# Altium project BCM_ECU.PrjPcb (part 1 of 2)
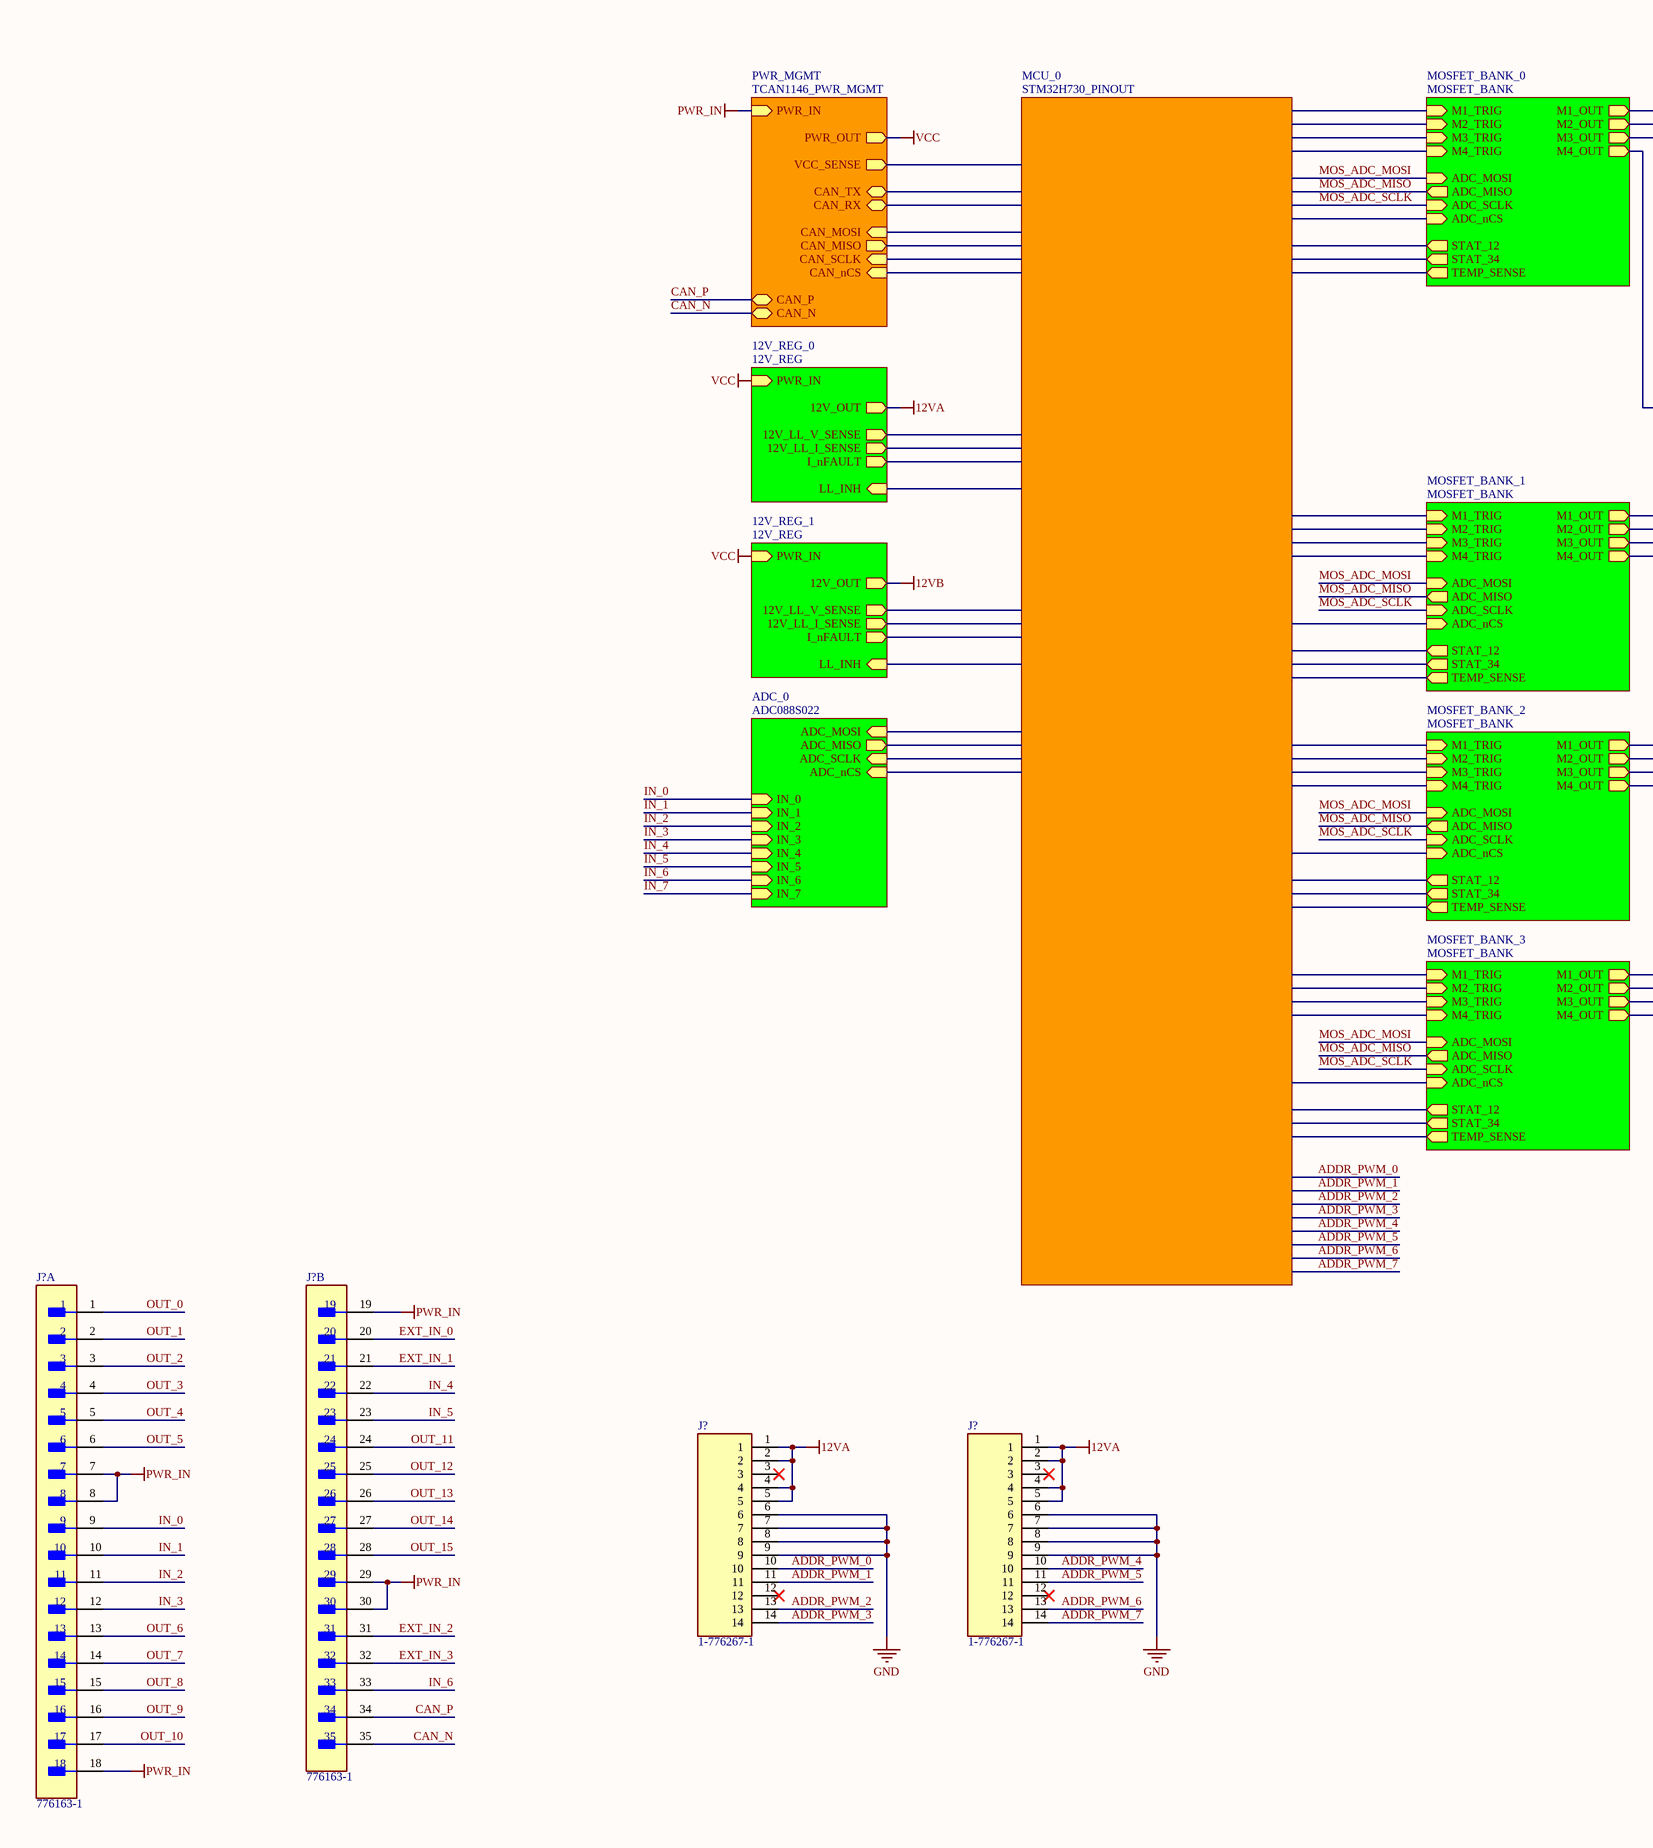
[diagram p0: BCM_ECU.SchDoc, left]
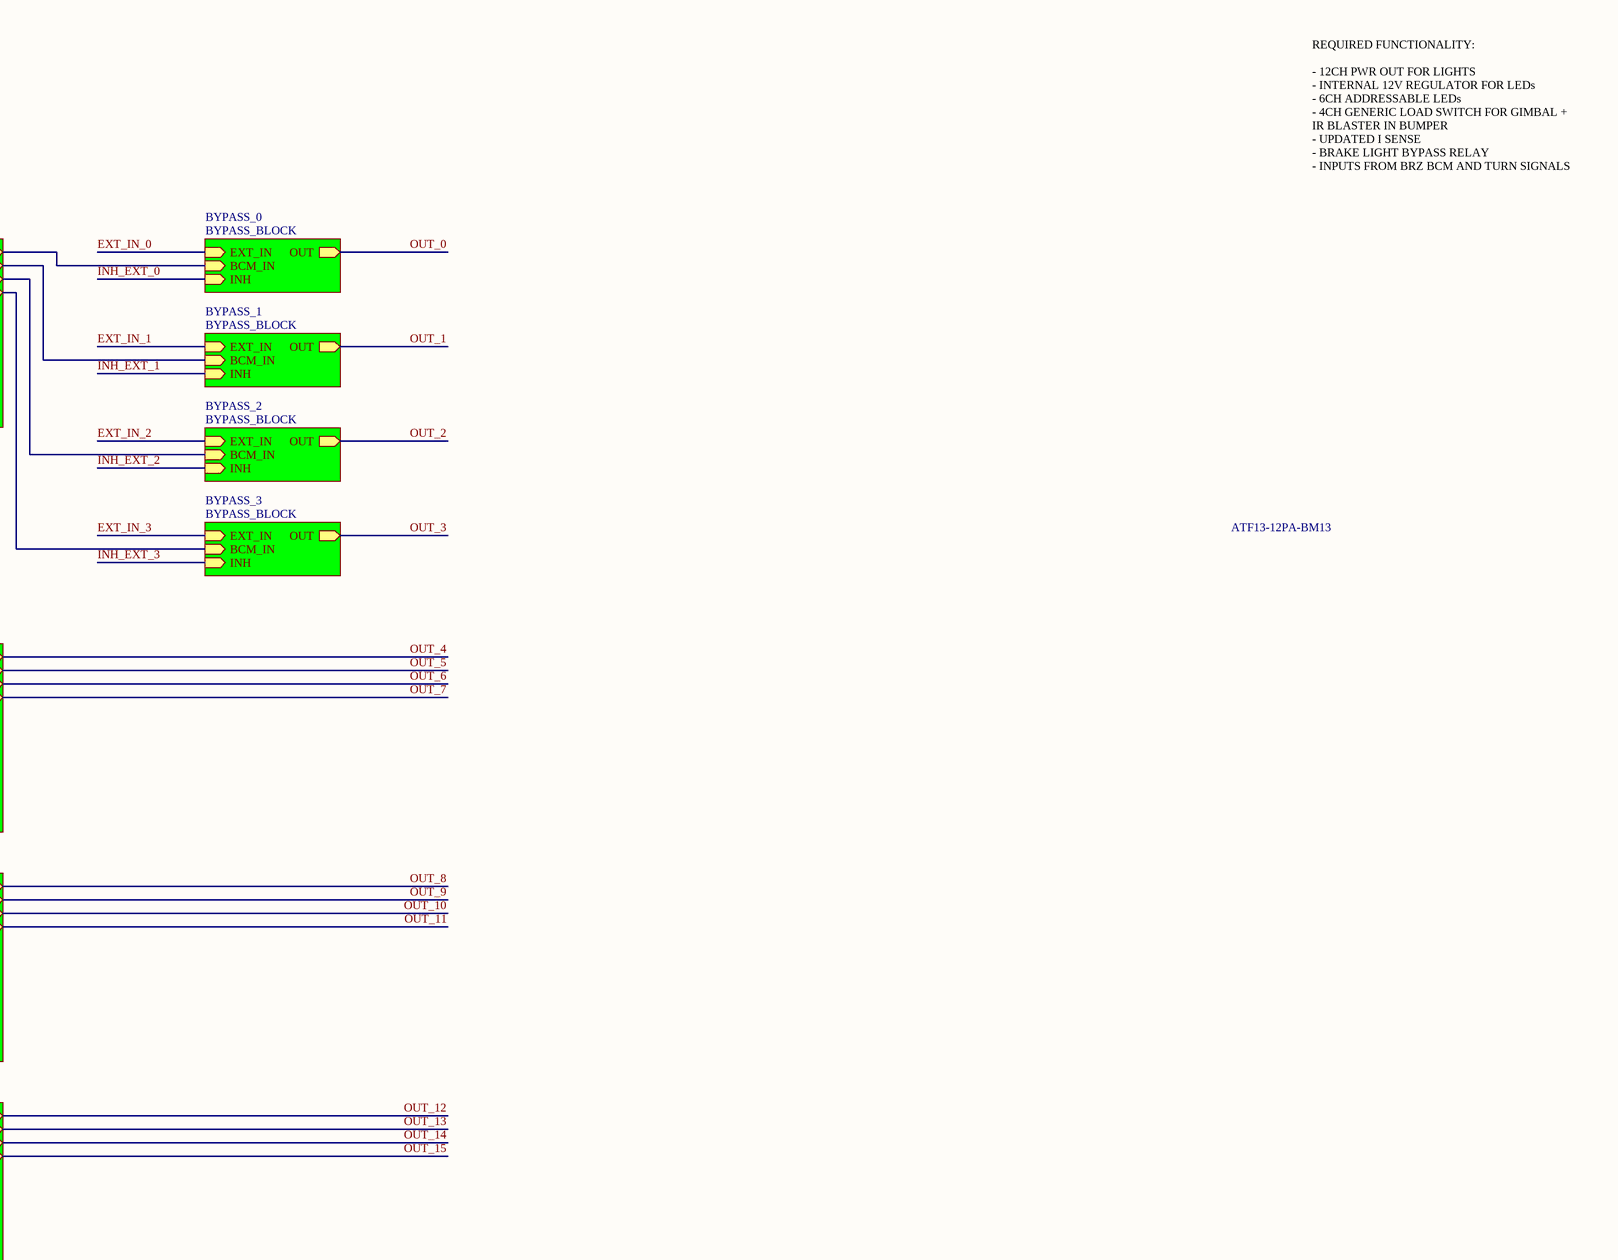
[diagram p1: BCM_ECU.SchDoc, right]
7 sheets, 308 parts. Net scope: hierarchical (ports join the sheet entries above them; power ports are global).
Board file: BCM_ECU_revA.PcbDoc
Sheets:
  BCM_ECU.SchDoc
    MCU_0 = STM32H730_PINOUT.SchDoc
    PWR_MGMT = TCAN1146_PWR_MGMT.SchDoc
    MOSFET_BANK_0 = MOSFET_BANK.SchDoc
    MOSFET_BANK_1 = MOSFET_BANK.SchDoc
    MOSFET_BANK_2 = MOSFET_BANK.SchDoc
    12V_REG_0 = 12V_REG.SchDoc
    12V_REG_1 = 12V_REG.SchDoc
    ADC_0 = ADC088S022.SchDoc
    BYPASS_0 = BYPASS_BLOCK.SchDoc
    MOSFET_BANK_3 = MOSFET_BANK.SchDoc
    BYPASS_1 = BYPASS_BLOCK.SchDoc
    BYPASS_2 = BYPASS_BLOCK.SchDoc
    BYPASS_3 = BYPASS_BLOCK.SchDoc

## Sheet BCM_ECU.SchDoc
size C; SheetNumber: 1; SheetTotal: 7

### Parts
(Parts that share a designator on the sheet are numbered #1, #2 ... from top to bottom, then left to right.)
J?#1  776163-1  [FP-776163-1-MFG]  (part A of 2)
J?#2  776163-1  [FP-776163-1-MFG]  (part B of 2)
J?#3  1-776267-1  [1-776267-2-Footprint-1]
J?#4  1-776267-1  [1-776267-2-Footprint-1]

### Sub-sheets
12V_REG_0 = 12V_REG: PWR_IN (in), LL_INH (in), 12V_OUT (out), 12V_LL_V_SENSE (out), 12V_LL_I_SENSE (out), I_nFAULT (out)
12V_REG_1 = 12V_REG: PWR_IN (in), LL_INH (in), 12V_OUT (out), 12V_LL_V_SENSE (out), 12V_LL_I_SENSE (out), I_nFAULT (out)
ADC_0 = ADC088S022: IN_0 (in), IN_1 (in), IN_2 (in), IN_3 (in), IN_4 (in), IN_5 (in), IN_6 (in), IN_7 (in), ADC_MOSI (in), ADC_MISO (out), ADC_SCLK (in), ADC_nCS (in)
BYPASS_0 = BYPASS_BLOCK: EXT_IN (in), OUT (out), INH (in), BCM_IN (in)
BYPASS_1 = BYPASS_BLOCK: EXT_IN (in), OUT (out), INH (in), BCM_IN (in)
BYPASS_2 = BYPASS_BLOCK: EXT_IN (in), OUT (out), INH (in), BCM_IN (in)
BYPASS_3 = BYPASS_BLOCK: EXT_IN (in), OUT (out), INH (in), BCM_IN (in)
MCU_0 = STM32H730_PINOUT: no entries
MOSFET_BANK_0 = MOSFET_BANK: M1_OUT (out), M2_OUT (out), M3_OUT (out), M4_OUT (out), M1_TRIG (in), M2_TRIG (in), M3_TRIG (in), M4_TRIG (in), STAT_12 (out), STAT_34 (out), ADC_MOSI (in), ADC_MISO (out), ADC_SCLK (in), ADC_nCS (in), TEMP_SENSE (out)
MOSFET_BANK_1 = MOSFET_BANK: M1_OUT (out), M2_OUT (out), M3_OUT (out), M4_OUT (out), M1_TRIG (in), M2_TRIG (in), M3_TRIG (in), M4_TRIG (in), STAT_12 (out), STAT_34 (out), ADC_MOSI (in), ADC_MISO (out), ADC_SCLK (in), ADC_nCS (in), TEMP_SENSE (out)
MOSFET_BANK_2 = MOSFET_BANK: M1_OUT (out), M2_OUT (out), M3_OUT (out), M4_OUT (out), M1_TRIG (in), M2_TRIG (in), M3_TRIG (in), M4_TRIG (in), STAT_12 (out), STAT_34 (out), ADC_MOSI (in), ADC_MISO (out), ADC_SCLK (in), ADC_nCS (in), TEMP_SENSE (out)
MOSFET_BANK_3 = MOSFET_BANK: M1_OUT (out), M2_OUT (out), M3_OUT (out), M4_OUT (out), M1_TRIG (in), M2_TRIG (in), M3_TRIG (in), M4_TRIG (in), STAT_12 (out), STAT_34 (out), ADC_MOSI (in), ADC_MISO (out), ADC_SCLK (in), ADC_nCS (in), TEMP_SENSE (out)
PWR_MGMT = TCAN1146_PWR_MGMT: PWR_IN (in), PWR_OUT (out), VCC_SENSE (out), CAN_TX (bidir), CAN_RX (bidir), CAN_SCLK (in), CAN_MISO (out), CAN_MOSI (in), CAN_nCS (in), CAN_P (bidir), CAN_N (bidir)

### Nets
12VA: J?#3.1 J?#3.2 J?#3.4 J?#3.5 J?#4.1 J?#4.2 J?#4.4 J?#4.5 ; sheet 12V_REG_0/12V_OUT  [project net 12V_OUT]
GND: J?#3.6 J?#3.7 J?#3.8 J?#3.9 J?#4.6 J?#4.7 J?#4.8 J?#4.9
PWR_IN: J?#1.7 J?#1.8 J?#1.18 J?#2.19 J?#2.29 J?#2.30 ; sheet PWR_MGMT/PWR_IN
VCC: sheet PWR_MGMT/PWR_OUT, sheet 12V_REG_0/PWR_IN, sheet 12V_REG_1/PWR_IN  [project net PWR_IN]
ADDR_PWM_0: J?#3.10
ADDR_PWM_1: J?#3.11
ADDR_PWM_2: J?#3.13
ADDR_PWM_3: J?#3.14
ADDR_PWM_4: J?#4.10
ADDR_PWM_5: J?#4.11
ADDR_PWM_6: J?#4.13
ADDR_PWM_7: J?#4.14
CAN_N: J?#2.35 ; sheet PWR_MGMT/CAN_N
CAN_P: J?#2.34 ; sheet PWR_MGMT/CAN_P
EXT_IN_0: J?#2.20 ; sheet BYPASS_0/EXT_IN
EXT_IN_1: J?#2.21 ; sheet BYPASS_1/EXT_IN
EXT_IN_2: J?#2.31 ; sheet BYPASS_2/EXT_IN
EXT_IN_3: J?#2.32 ; sheet BYPASS_3/EXT_IN
IN_0: J?#1.9 ; sheet ADC_0/IN_0
IN_1: J?#1.10 ; sheet ADC_0/IN_1
IN_2: J?#1.11 ; sheet ADC_0/IN_2
IN_3: J?#1.12 ; sheet ADC_0/IN_3
IN_4: J?#2.22 ; sheet ADC_0/IN_4
IN_5: J?#2.23 ; sheet ADC_0/IN_5
IN_6: J?#2.33 ; sheet ADC_0/IN_6
IN_7: sheet ADC_0/IN_7
MOS_ADC_MISO: sheet MOSFET_BANK_0/ADC_MISO, sheet MOSFET_BANK_1/ADC_MISO, sheet MOSFET_BANK_2/ADC_MISO, sheet MOSFET_BANK_3/ADC_MISO  [project net ADC_MISO]
MOS_ADC_MOSI: sheet MOSFET_BANK_0/ADC_MOSI, sheet MOSFET_BANK_1/ADC_MOSI, sheet MOSFET_BANK_2/ADC_MOSI, sheet MOSFET_BANK_3/ADC_MOSI  [project net ADC_MOSI]
MOS_ADC_SCLK: sheet MOSFET_BANK_0/ADC_SCLK, sheet MOSFET_BANK_1/ADC_SCLK, sheet MOSFET_BANK_2/ADC_SCLK, sheet MOSFET_BANK_3/ADC_SCLK  [project net ADC_SCLK]
OUT_0: J?#1.1 ; sheet MOSFET_BANK_0/M1_OUT, sheet BYPASS_0/OUT, sheet BYPASS_0/BCM_IN  [project net M1_OUT]
OUT_1: J?#1.2 ; sheet MOSFET_BANK_0/M2_OUT, sheet BYPASS_1/OUT, sheet BYPASS_1/BCM_IN  [project net M2_OUT]
OUT_2: J?#1.3 ; sheet MOSFET_BANK_0/M3_OUT, sheet BYPASS_2/OUT, sheet BYPASS_2/BCM_IN  [project net M3_OUT]
OUT_3: J?#1.4 ; sheet MOSFET_BANK_0/M4_OUT, sheet BYPASS_3/OUT, sheet BYPASS_3/BCM_IN  [project net M4_OUT]
OUT_4: J?#1.5 ; sheet MOSFET_BANK_1/M1_OUT  [project net M1_OUT]
OUT_5: J?#1.6 ; sheet MOSFET_BANK_1/M2_OUT  [project net M2_OUT]
OUT_6: J?#1.13 ; sheet MOSFET_BANK_1/M3_OUT  [project net M3_OUT]
OUT_7: J?#1.14 ; sheet MOSFET_BANK_1/M4_OUT  [project net M4_OUT]
OUT_8: J?#1.15 ; sheet MOSFET_BANK_2/M1_OUT  [project net M1_OUT]
OUT_9: J?#1.16 ; sheet MOSFET_BANK_2/M2_OUT  [project net M2_OUT]
OUT_10: J?#1.17 ; sheet MOSFET_BANK_2/M3_OUT  [project net M3_OUT]
OUT_11: J?#2.24 ; sheet MOSFET_BANK_2/M4_OUT  [project net M4_OUT]
OUT_12: J?#2.25 ; sheet MOSFET_BANK_3/M1_OUT  [project net M1_OUT]
OUT_13: J?#2.26 ; sheet MOSFET_BANK_3/M2_OUT  [project net M2_OUT]
OUT_14: J?#2.27 ; sheet MOSFET_BANK_3/M3_OUT  [project net M3_OUT]
OUT_15: J?#2.28 ; sheet MOSFET_BANK_3/M4_OUT  [project net M4_OUT]

Not connected (* = marked no-connect by the designer): J?#3 3* 12*; J?#4 3* 12*

### Notes on the sheet
- REQUIRED FUNCTIONALITY:
  - 12CH PWR OUT FOR LIGHTS
  - INTERNAL 12V REGULATOR FOR LEDs
  - 6CH ADDRESSABLE LEDs
  - 4CH GENERIC LOAD SWITCH FOR GIMBAL + IR BLASTER IN BUMPER
  - UPDATED I SENSE
  - BRAKE LIGHT BYPASS RELAY
  - INPUTS FROM BRZ BCM AND TURN SIGNALS
- ATF13-12PA-BM13

### Library data of the parts
J?#1 J?#2 = CMP-03369-000154-1: CONN HEADER R/A 35POS 4MM; Primary Type: Rectangular; Circuit Application: Power; Tab Thickness: 1.3mm; Number of Signal Positions: 35; Shielding: Unshielded; Pitch: 0.157inch; Max Voltage Rating (AC): 250V; Connector System: Wire-to-Device; Insulation: Insulated; Current Rating: 17A; PCB Thickness: 0.062inch; PCB Mount Retention: With; Gender: Male; Connector Type: Male Pin; PCB Mount Alignment: Yes (With); Series: Ampseal; Depth: 37.9mm; Orientation: Right Angle; Length: 3.03inch; Termination: Solder; Radiation Hardening: No; Number of Rows: 3; Contact Plating: Tin; Lead Free: Lead Free; Flammability Rating: UL94 V-0; Contact Material: Brass; Number of Contacts: 35; ELV: Compliant; Max Operating Temperature: 221°C; Min Operating Temperature: -40°C; Package Quantity: 1; Mount: Through Hole; Contact Type: Male Pin; Housing Material: Thermoplastic; Number of Positions: 35; Packaging: Bulk; Row Spacing: 0.157inch; RoHS Compliant: Yes; Height: 32.1mm; Color: Black; Fastening Type: Ramp; Sealable: Yes (With); Width: 37.9mm
J?#3 J?#4 = CMP-002-00075-1: Combination Line Connector, 14 Contact(s), Male, Solder Terminal - MODEL IS CODE2 BUT USE CODE1; RoHS Compliant: Yes; Mounting Technology: Board

## Sheet STM32H730_PINOUT.SchDoc
size C; SheetNumber: 4; SheetTotal: 9
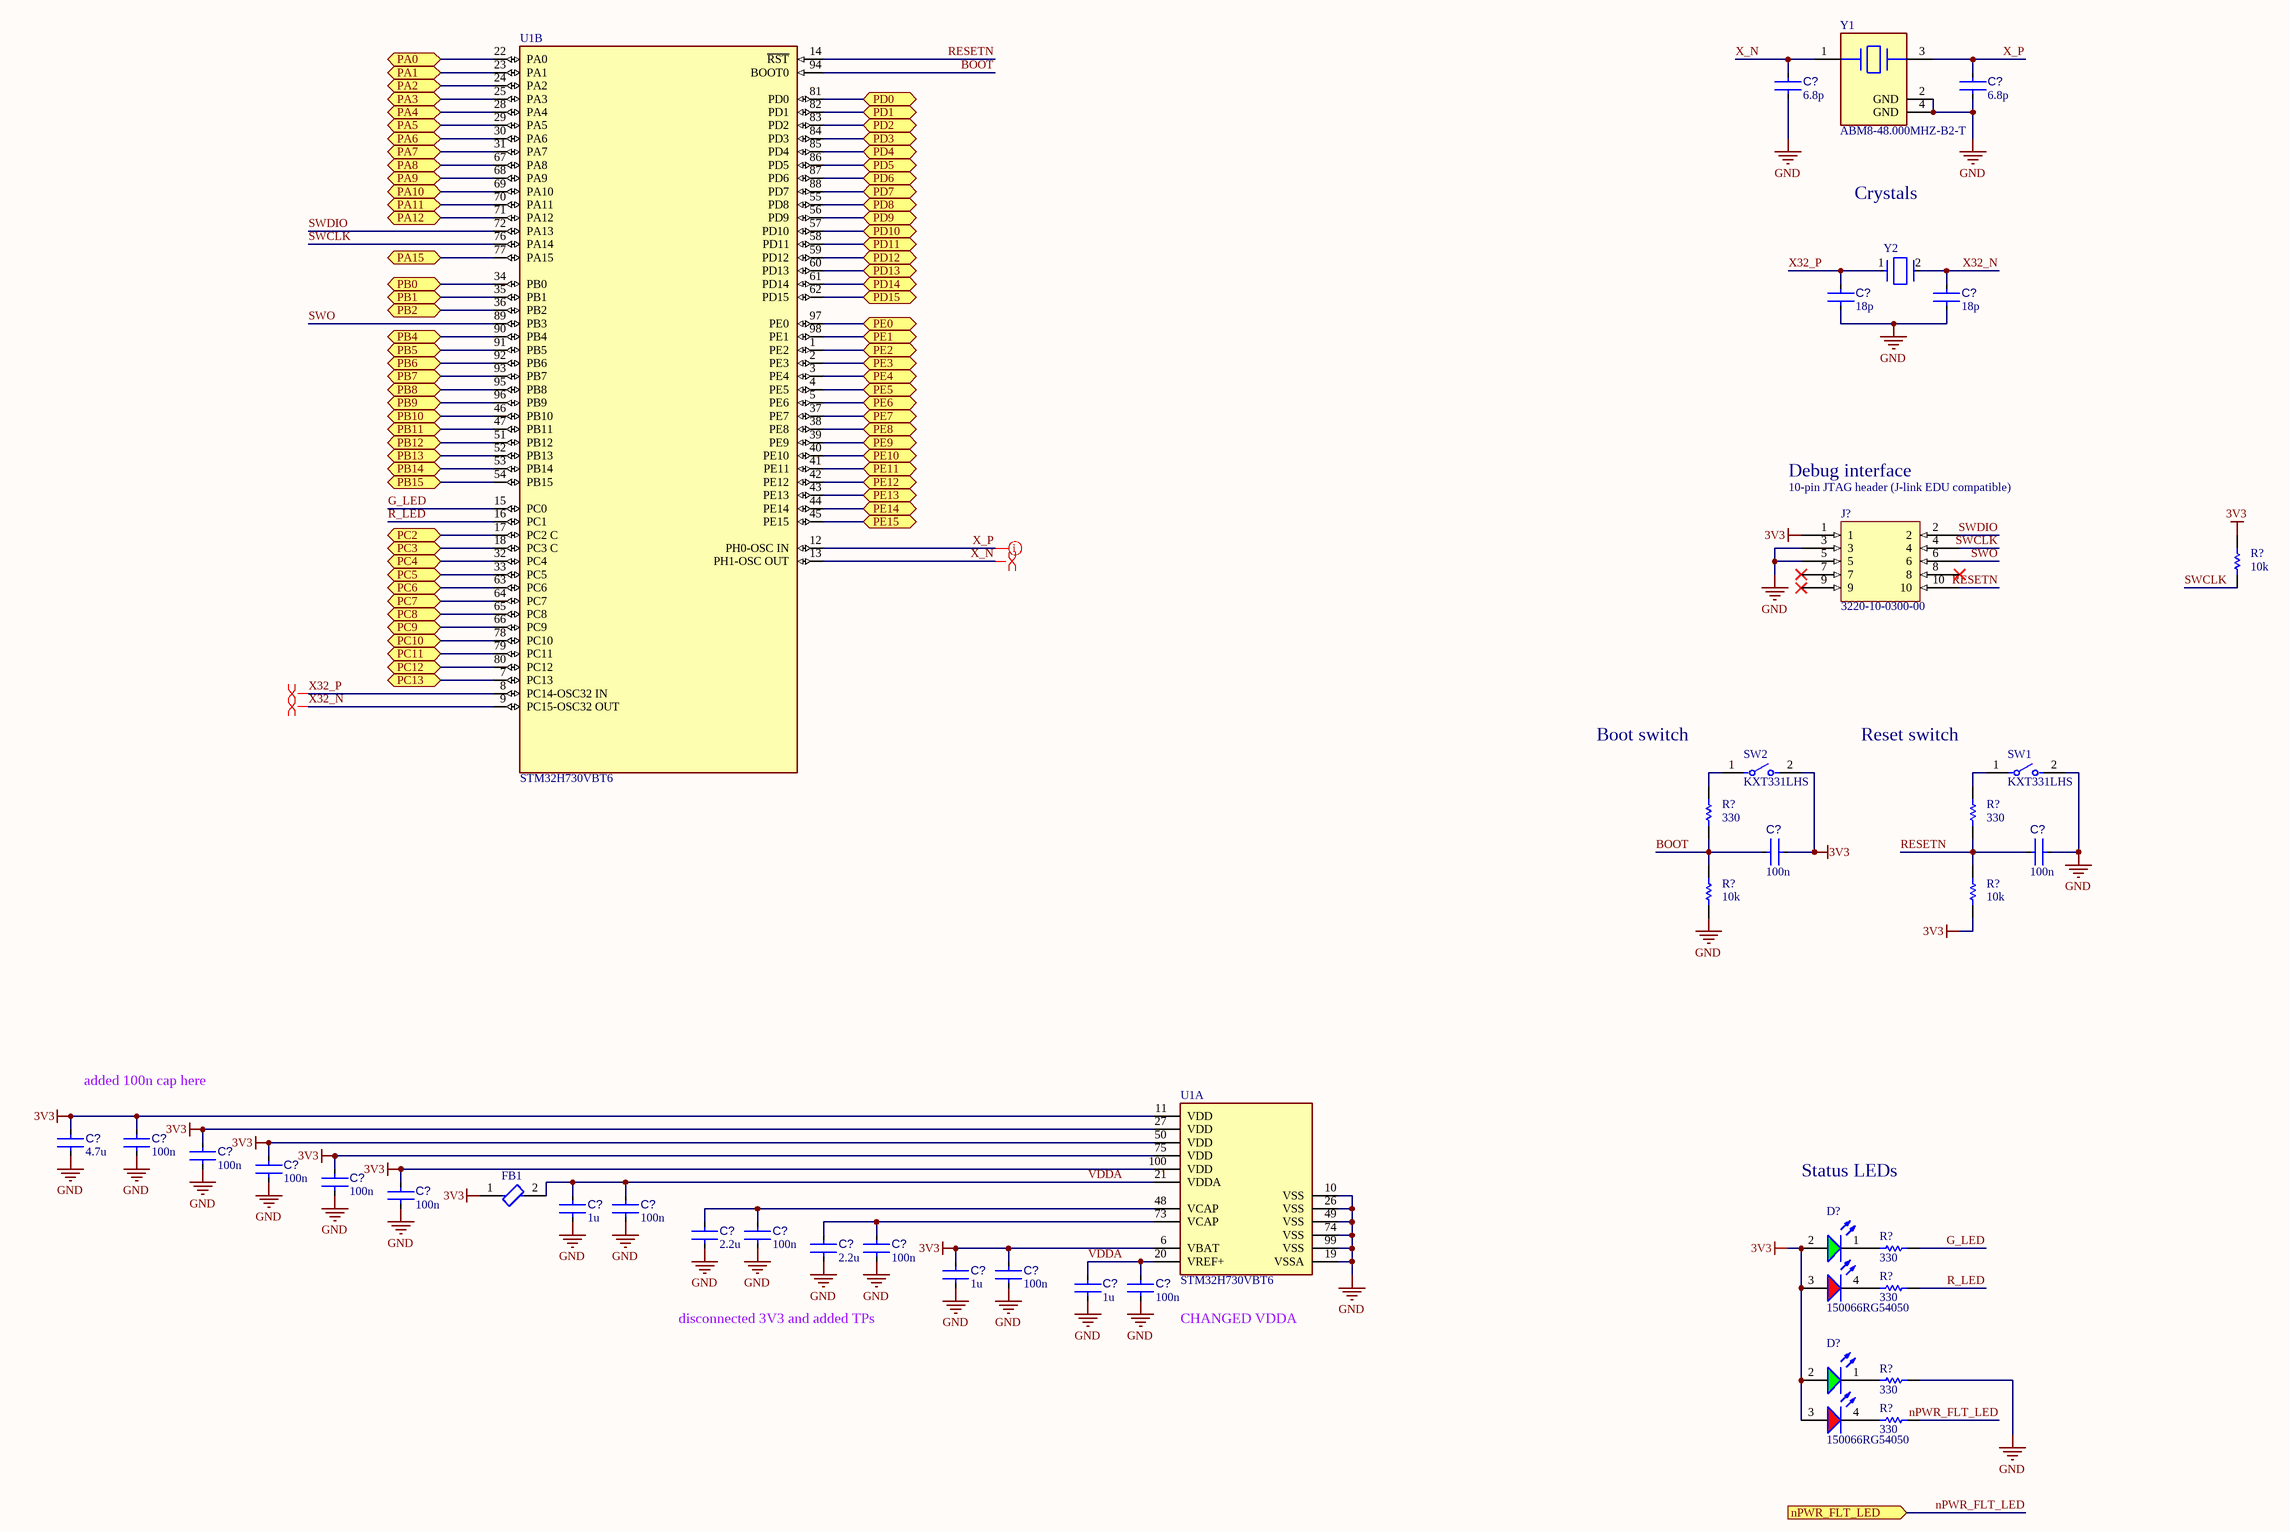
[diagram p2: STM32H730_PINOUT.SchDoc]

### Parts
(Parts that share a designator on the sheet are numbered #1, #2 ... from top to bottom, then left to right.)
C?#1  6.8p  [C0402B]
C?#2  6.8p  [C0402B]
C?#3  18p  [C0402B]
C?#4  18p  [C0402B]
C?#5  100n  [C0402B]
C?#6  100n  [C0402B]
C?#7  4.7u  [C0402B]
C?#8  100n  [C0402B]
C?#9  100n  [C0402B]
C?#10  100n  [C0402B]
C?#11  100n  [C0402B]
C?#12  100n  [C0402B]
C?#13  1u  [C0402B]
C?#14  100n  [C0402B]
C?#15  2.2u  [C0402B]
C?#16  100n  [C0402B]
C?#17  2.2u  [C0402B]
C?#18  100n  [C0402B]
C?#19  1u  [C0402B]
C?#20  100n  [C0402B]
C?#21  1u  [C0402B]
C?#22  100n  [C0402B]
D?#1  150066RG54050  [WL-SBCD_0606]
D?#2  150066RG54050  [WL-SBCD_0606]
FB1  BLM15PX601SN1D  [FP-BLM15-0_05-IPC_A]  (value not drawn)
J?#5  3220-10-0300-00  [3220-10-0300-00-Footprint-1]
R?#1  10k  [R0603B]
R?#2  330  [R0603B]
R?#3  330  [R0603B]
R?#4  10k  [R0603B]
R?#5  10k  [R0603B]
R?#6  330  [R0603B]
R?#7  330  [R0603B]
R?#8  330  [R0603B]
R?#9  330  [R0603B]
SW1  KXT331LHS  [FP-KXT331LHS-MFG]
SW2  KXT331LHS  [FP-KXT331LHS-MFG]
U1  STM32H730VBT6  [FP-LQFP100-1L-IPC_C]  (parts A,B of 2)
Y1  ABM8-48.000MHZ-B2-T  [FP-ABM8-MFG]
Y2  ECS-.327-12.5-1210-TR  [FP-ECX-1210-MFG]  (value not drawn)

### Ports
nPWR_FLT_LED (in), PA0 (bidir), PA1 (bidir), PA2 (bidir), PA3 (bidir), PA4 (bidir), PA5 (bidir), PA6 (bidir), PA7 (bidir), PA8 (bidir), PA9 (bidir), PA10 (bidir), PA11 (bidir), PA12 (bidir), PA15 (bidir), PB0 (bidir), PB1 (bidir), PB2 (bidir), PB4 (bidir), PB5 (bidir), PB6 (bidir), PB7 (bidir), PB8 (bidir), PB9 (bidir), PB10 (bidir), PB11 (bidir), PB12 (bidir), PB13 (bidir), PB14 (bidir), PB15 (bidir), PC2 (bidir), PC3 (bidir), PC4 (bidir), PC5 (bidir), PC6 (bidir), PC7 (bidir), PC8 (bidir), PC9 (bidir), PC10 (bidir), PC11 (bidir), PC12 (bidir), PC13 (bidir), PD0 (bidir), PD1 (bidir), PD2 (bidir), PD3 (bidir), PD4 (bidir), PD5 (bidir), PD6 (bidir), PD7 (bidir), PD8 (bidir), PD9 (bidir), PD10 (bidir), PD11 (bidir), PD12 (bidir), PD13 (bidir), PD14 (bidir), PD15 (bidir), PE0 (bidir), PE1 (bidir), PE2 (bidir), PE3 (bidir), PE4 (bidir), PE5 (bidir), PE6 (bidir), PE7 (bidir), PE8 (bidir), PE9 (bidir), PE10 (bidir), PE11 (bidir), PE12 (bidir), PE13 (bidir), PE14 (bidir), PE15 (bidir)

### Nets
3V3: C?#5.1 C?#7.2 C?#8.2 C?#9.2 C?#10.2 C?#11.2 C?#12.2 C?#19.2 C?#20.2 D?#1.2(A) D?#1.3(A) D?#2.2(A) D?#2.3(A) FB1.1 J?#5.1 R?#1.2 R?#5.1 SW2.2 U1.6(VBAT) U1.11(VDD) U1.27(VDD) U1.50(VDD) U1.75(VDD) U1.100(VDD)
GND: C?#1.1 C?#2.1 C?#3.1 C?#4.1 C?#6.1 C?#7.1 C?#8.1 C?#9.1 C?#10.1 C?#11.1 C?#12.1 C?#13.1 C?#14.1 C?#15.1 C?#16.1 C?#17.1 C?#18.1 C?#19.1 C?#20.1 C?#21.1 C?#22.1 J?#5.3 J?#5.5 R?#4.1 R?#8.1 SW1.2 U1.10(VSS) U1.19(VSSA) U1.26(VSS) U1.49(VSS) U1.74(VSS) U1.99(VSS) Y1.2(GND) Y1.4(GND)
BOOT: C?#5.2 R?#2.1 R?#4.2 U1.94(BOOT0)
G_LED: R?#6.1 U1.15(PC0)
nPWR_FLT_LED: R?#9.1 ; port nPWR_FLT_LED
R_LED: R?#7.1 U1.16(PC1)
RESETN: C?#6.2 J?#5.10 R?#3.1 R?#5.2 U1.14(~{RST})
SWCLK: J?#5.4 R?#1.1 U1.76(PA14)
SWDIO: J?#5.2 U1.72(PA13)
SWO: J?#5.6 U1.89(PB3)
VDDA: C?#13.2 C?#14.2 C?#21.2 C?#22.2 FB1.2 U1.20(VREF+) U1.21(VDDA)
X32_N: C?#4.2 U1.9(PC15-OSC32_OUT) Y2.2(Out/In)
X32_P: C?#3.2 U1.8(PC14-OSC32_IN) Y2.1(In/Out)
X_N: C?#1.2 U1.13(PH1-OSC_OUT) Y1.1
X_P: C?#2.2 U1.12(PH0-OSC_IN) Y1.3
NetC?#15_2: C?#15.2 C?#16.2 U1.48(VCAP)
NetC?#17_2: C?#17.2 C?#18.2 U1.73(VCAP)
NetD?#1_1: D?#1.1(K) R?#6.2
NetD?#1_4: D?#1.4(K) R?#7.2
NetD?#2_1: D?#2.1(K) R?#8.2
NetD?#2_4: D?#2.4(K) R?#9.2
NetR?#2_2: R?#2.2 SW2.1
NetR?#3_2: R?#3.2 SW1.1
NetU1_1: U1.1(PE2) ; port PE2
NetU1_2: U1.2(PE3) ; port PE3
NetU1_3: U1.3(PE4) ; port PE4
NetU1_4: U1.4(PE5) ; port PE5
NetU1_5: U1.5(PE6) ; port PE6
NetU1_7: U1.7(PC13) ; port PC13
NetU1_17: U1.17(PC2_C) ; port PC2
NetU1_18: U1.18(PC3_C) ; port PC3
NetU1_22: U1.22(PA0) ; port PA0
NetU1_23: U1.23(PA1) ; port PA1
NetU1_24: U1.24(PA2) ; port PA2
NetU1_25: U1.25(PA3) ; port PA3
NetU1_28: U1.28(PA4) ; port PA4
NetU1_29: U1.29(PA5) ; port PA5
NetU1_30: U1.30(PA6) ; port PA6
NetU1_31: U1.31(PA7) ; port PA7
NetU1_32: U1.32(PC4) ; port PC4
NetU1_33: U1.33(PC5) ; port PC5
NetU1_34: U1.34(PB0) ; port PB0
NetU1_35: U1.35(PB1) ; port PB1
NetU1_36: U1.36(PB2) ; port PB2
NetU1_37: U1.37(PE7) ; port PE7
NetU1_38: U1.38(PE8) ; port PE8
NetU1_39: U1.39(PE9) ; port PE9
NetU1_40: U1.40(PE10) ; port PE10
NetU1_41: U1.41(PE11) ; port PE11
NetU1_42: U1.42(PE12) ; port PE12
NetU1_43: U1.43(PE13) ; port PE13
NetU1_44: U1.44(PE14) ; port PE14
NetU1_45: U1.45(PE15) ; port PE15
NetU1_46: U1.46(PB10) ; port PB10
NetU1_47: U1.47(PB11) ; port PB11
NetU1_51: U1.51(PB12) ; port PB12
NetU1_52: U1.52(PB13) ; port PB13
NetU1_53: U1.53(PB14) ; port PB14
NetU1_54: U1.54(PB15) ; port PB15
NetU1_55: U1.55(PD8) ; port PD8
NetU1_56: U1.56(PD9) ; port PD9
NetU1_57: U1.57(PD10) ; port PD10
NetU1_58: U1.58(PD11) ; port PD11
NetU1_59: U1.59(PD12) ; port PD12
NetU1_60: U1.60(PD13) ; port PD13
NetU1_61: U1.61(PD14) ; port PD14
NetU1_62: U1.62(PD15) ; port PD15
NetU1_63: U1.63(PC6) ; port PC6
NetU1_64: U1.64(PC7) ; port PC7
NetU1_65: U1.65(PC8) ; port PC8
NetU1_66: U1.66(PC9) ; port PC9
NetU1_67: U1.67(PA8) ; port PA8
NetU1_68: U1.68(PA9) ; port PA9
NetU1_69: U1.69(PA10) ; port PA10
NetU1_70: U1.70(PA11) ; port PA11
NetU1_71: U1.71(PA12) ; port PA12
NetU1_77: U1.77(PA15) ; port PA15
NetU1_78: U1.78(PC10) ; port PC10
NetU1_79: U1.79(PC11) ; port PC11
NetU1_80: U1.80(PC12) ; port PC12
NetU1_81: U1.81(PD0) ; port PD0
NetU1_82: U1.82(PD1) ; port PD1
NetU1_83: U1.83(PD2) ; port PD2
NetU1_84: U1.84(PD3) ; port PD3
NetU1_85: U1.85(PD4) ; port PD4
NetU1_86: U1.86(PD5) ; port PD5
NetU1_87: U1.87(PD6) ; port PD6
NetU1_88: U1.88(PD7) ; port PD7
NetU1_90: U1.90(PB4) ; port PB4
NetU1_91: U1.91(PB5) ; port PB5
NetU1_92: U1.92(PB6) ; port PB6
NetU1_93: U1.93(PB7) ; port PB7
NetU1_95: U1.95(PB8) ; port PB8
NetU1_96: U1.96(PB9) ; port PB9
NetU1_97: U1.97(PE0) ; port PE0
NetU1_98: U1.98(PE1) ; port PE1

Not connected (* = marked no-connect by the designer): J?#5 7* 8* 9*

### Layout directives
differential pair: X32_N, X32_P, X_N, X_P

### Notes on the sheet
- Crystals
- Debug interface
- (near J?#5) 10-pin JTAG header (J-link EDU compatible)
- Boot switch
- Reset switch
- (near C?#8) added 100n cap here
- Status LEDs
- disconnected 3V3 and added TPs
- CHANGED VDDA

### Library data of the parts
C?#1-C?#22 = CMP-001-00000-11: Non-polarized capacitor
D?#1 D?#2 = CMP-004-00040-2: Led, Red/Grn, 180Mcd/230Mcd, 624Nm/525Nm Rohs Compliant: Yes; Source: rgled.SchLib; Component Type: Standard; Design Item ID: CMP-004-00034-2; Pins: 4
FB1 = CMP-0686-00252-4: Chip Ferrite Bead, 0402, 600Ω @ 100MHz, 0.23Ω, 25%, 900mA; Number of Circuits: 1; Impedance: 600R; DC Resistance (DCR): 230mR; Material: Steel; Length: 1mm; Package Quantity: 10000; Height: 0.5mm; Width: 0.5mm; Max DC Current: 900mA; Number of Lines: 1; Termination: SMD/SMT; Packaging: Tape and Reel; Lead Free: Lead Free; Min Operating Temperature: -55°C; Max Operating Temperature: 125°C; Max Current Rating: 900mA; Case Code (Imperial): 0402; Number of Pins: 2; Current Rating: 900mA; Test Frequency: 100MHz; Case/Package: 0402; Tolerance: 25%; Case Code (Metric): 1005
J?#5 = CMP-001-0013-3: CONN HEADER SMD 10POS 1.27MM
R?#1-R?#9 = CMP-009-00002-14: Resistor
  R?#1 R?#4 R?#5: Value: 10k
  R?#2 R?#3 R?#6-R?#9: Value: 330
SW1 SW2 = CMP-10040-000029-1: SWITCH TACTILE SPST-NO 0.02A 15V; Operating Force: 240gf; Switch Travel: 0.13mm; Illumination Type: Non-Illuminated; Throw Configuration: SPST; Number of Ports: 1; Current Rating: 5A; Mechanical Life: 500000Cycles; Switch Function: Off-Mom; Connector Type: USB; Actuator Type: Standard; Gender: Receptacle; Number of Contacts: 24; Contact Plating: Gold; Insulation Color: Black; Min Operating Temperature: -40°C; Packaging: Tape and Reel; Flammability Rating: UL94 V-0; Max Operating Temperature: 85°C; Termination: Solder; Mount: Surface Mount
U1 = CMP-12105-000107-1: IC MCU 32BIT 128KB FLASH 100LQFP
Y1 = CMP-27762-011708-1: Crystal 48MHz ±20ppm 18pF SMD-4 3.2mm x 2.5mm; Series Resistance: 35R; Frequency Stability: 50ppm; Package Quantity: 1000; Packaging: Tape and Reel; Mount: Surface Mount; Length: 3.2mm; Load Capacitance: 18pF; Max Operating Temperature: 70°C; Operating Frequency: 48 MHz; RoHS Compliant: Yes; Series: ABM8; Frequency Tolerance: 20ppm; Lead Free: Lead Free; Min Operating Temperature: -20°C; Case/Package: CSMD; Number of Pins: 4; Height: 0.031inch; ESR (Equivalent Series Resistance): 35R; Frequency: 48MHz; Radiation Hardening: No; Width: 0.098inch; Tolerance: 20ppm; Termination: SMD/SMT; Depth: 2.5mm; Resistor Type: Ceramic; REACH SVHC: No SVHC
Y2 = CMP-40224-000006-1: CRYSTAL 32.7680KHZ 12.5PF SMD; Manufacturer: ECS International; Frequency: 32.768kHz; Esr: 90kΩ; Tolerance: 20ppm; Device Class L1: Passive Components; Load Capacitance: 12.5pF; Temperature: -40°C to +85°C; ComponentLink2URL: https://ecsxtal.com/store/pdf/ECX-1210.pdf; Series: ECX-1210; Octopart: https://octopart.com/ecs-.327-12.5-1210-tr-ecs+international-81221340; ComponentLink2Description: Datasheet; Temperature Range Low: -40°C; Digikey Description: CRYSTAL 32.7680KHZ 12.5PF SMD; Lead Free: Yes; RoHS: TRUE; Device Class L3: Crystals; Automotive: No; Category: Crys; Height: 0.5mm; Manufacturer Part Number: ECS-.327-12.5-1210-TR; Temperature Range High: +85°C; Device Class L2: Crystals / Oscillators; Package: ECX-1210

## Sheet TCAN1146_PWR_MGMT.SchDoc
size C; SheetNumber: 3; SheetTotal: 9
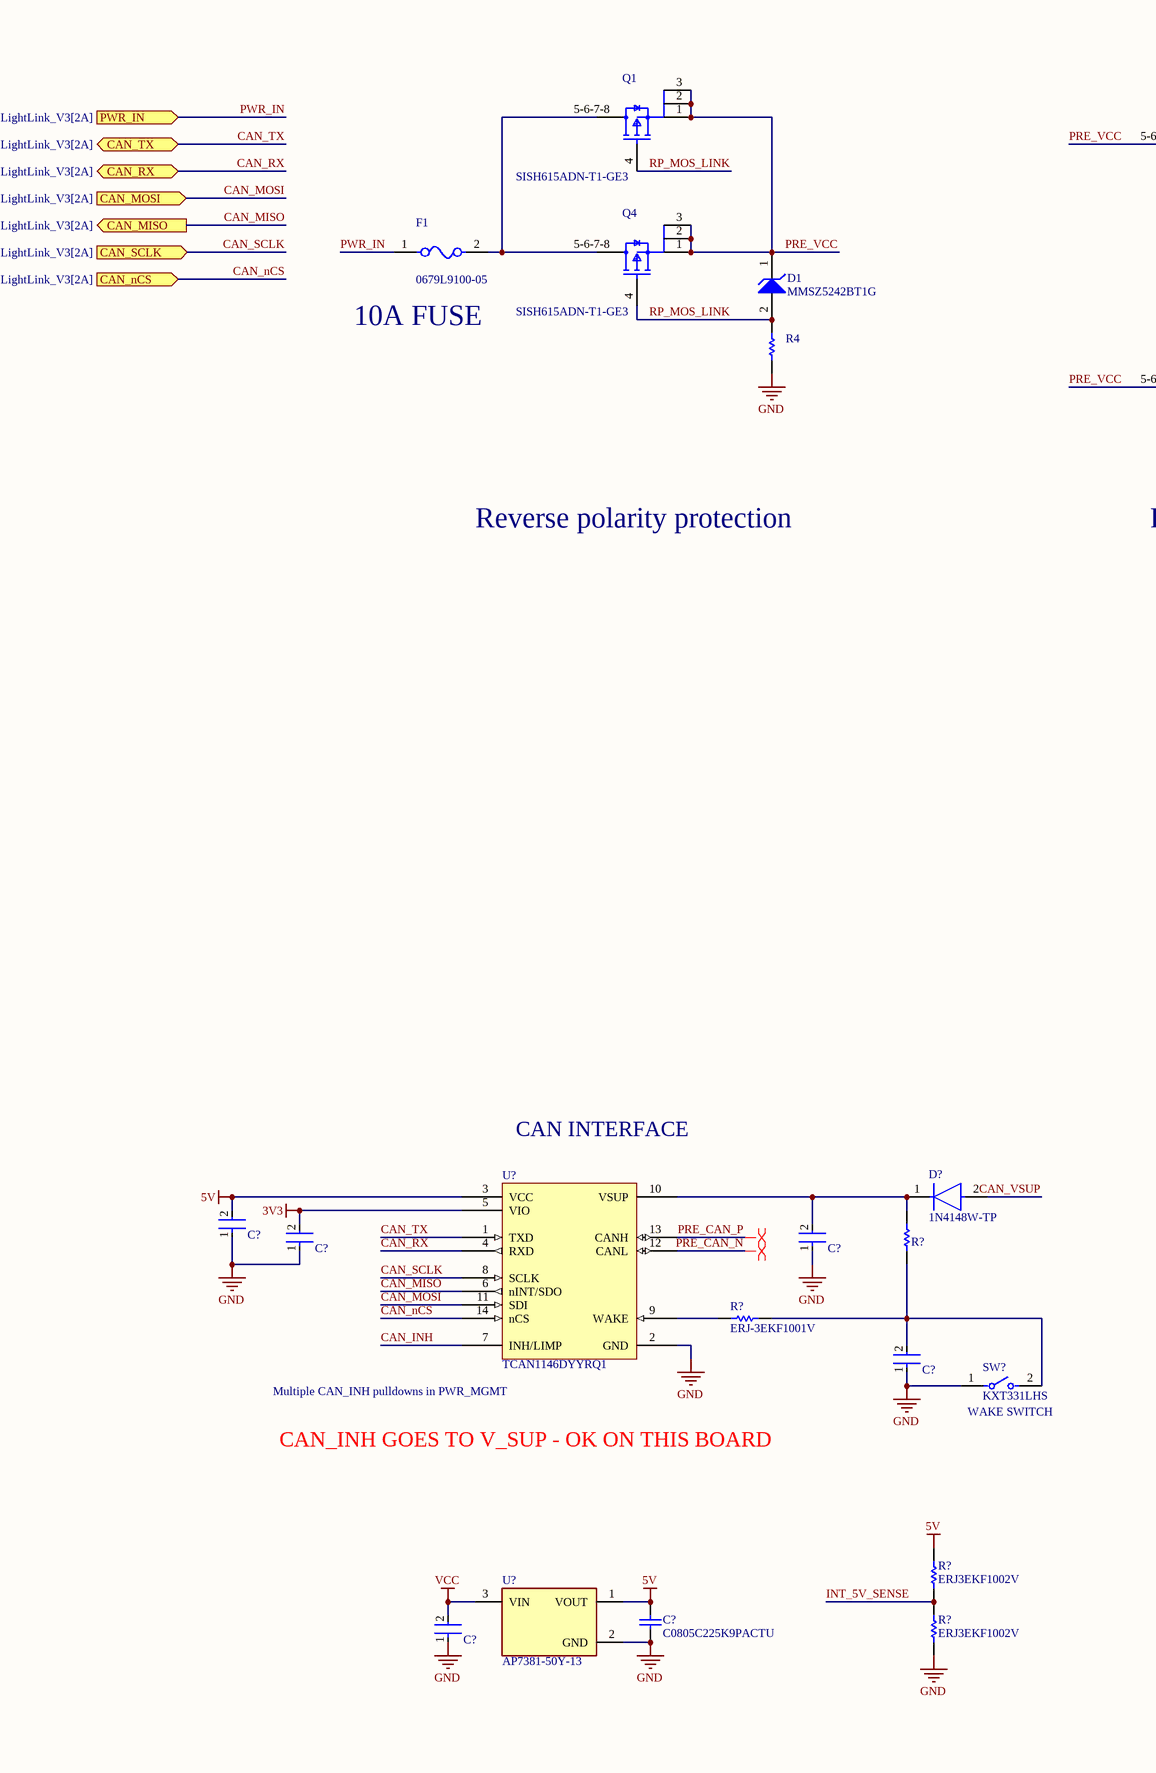
[diagram p3: TCAN1146_PWR_MGMT.SchDoc, left]
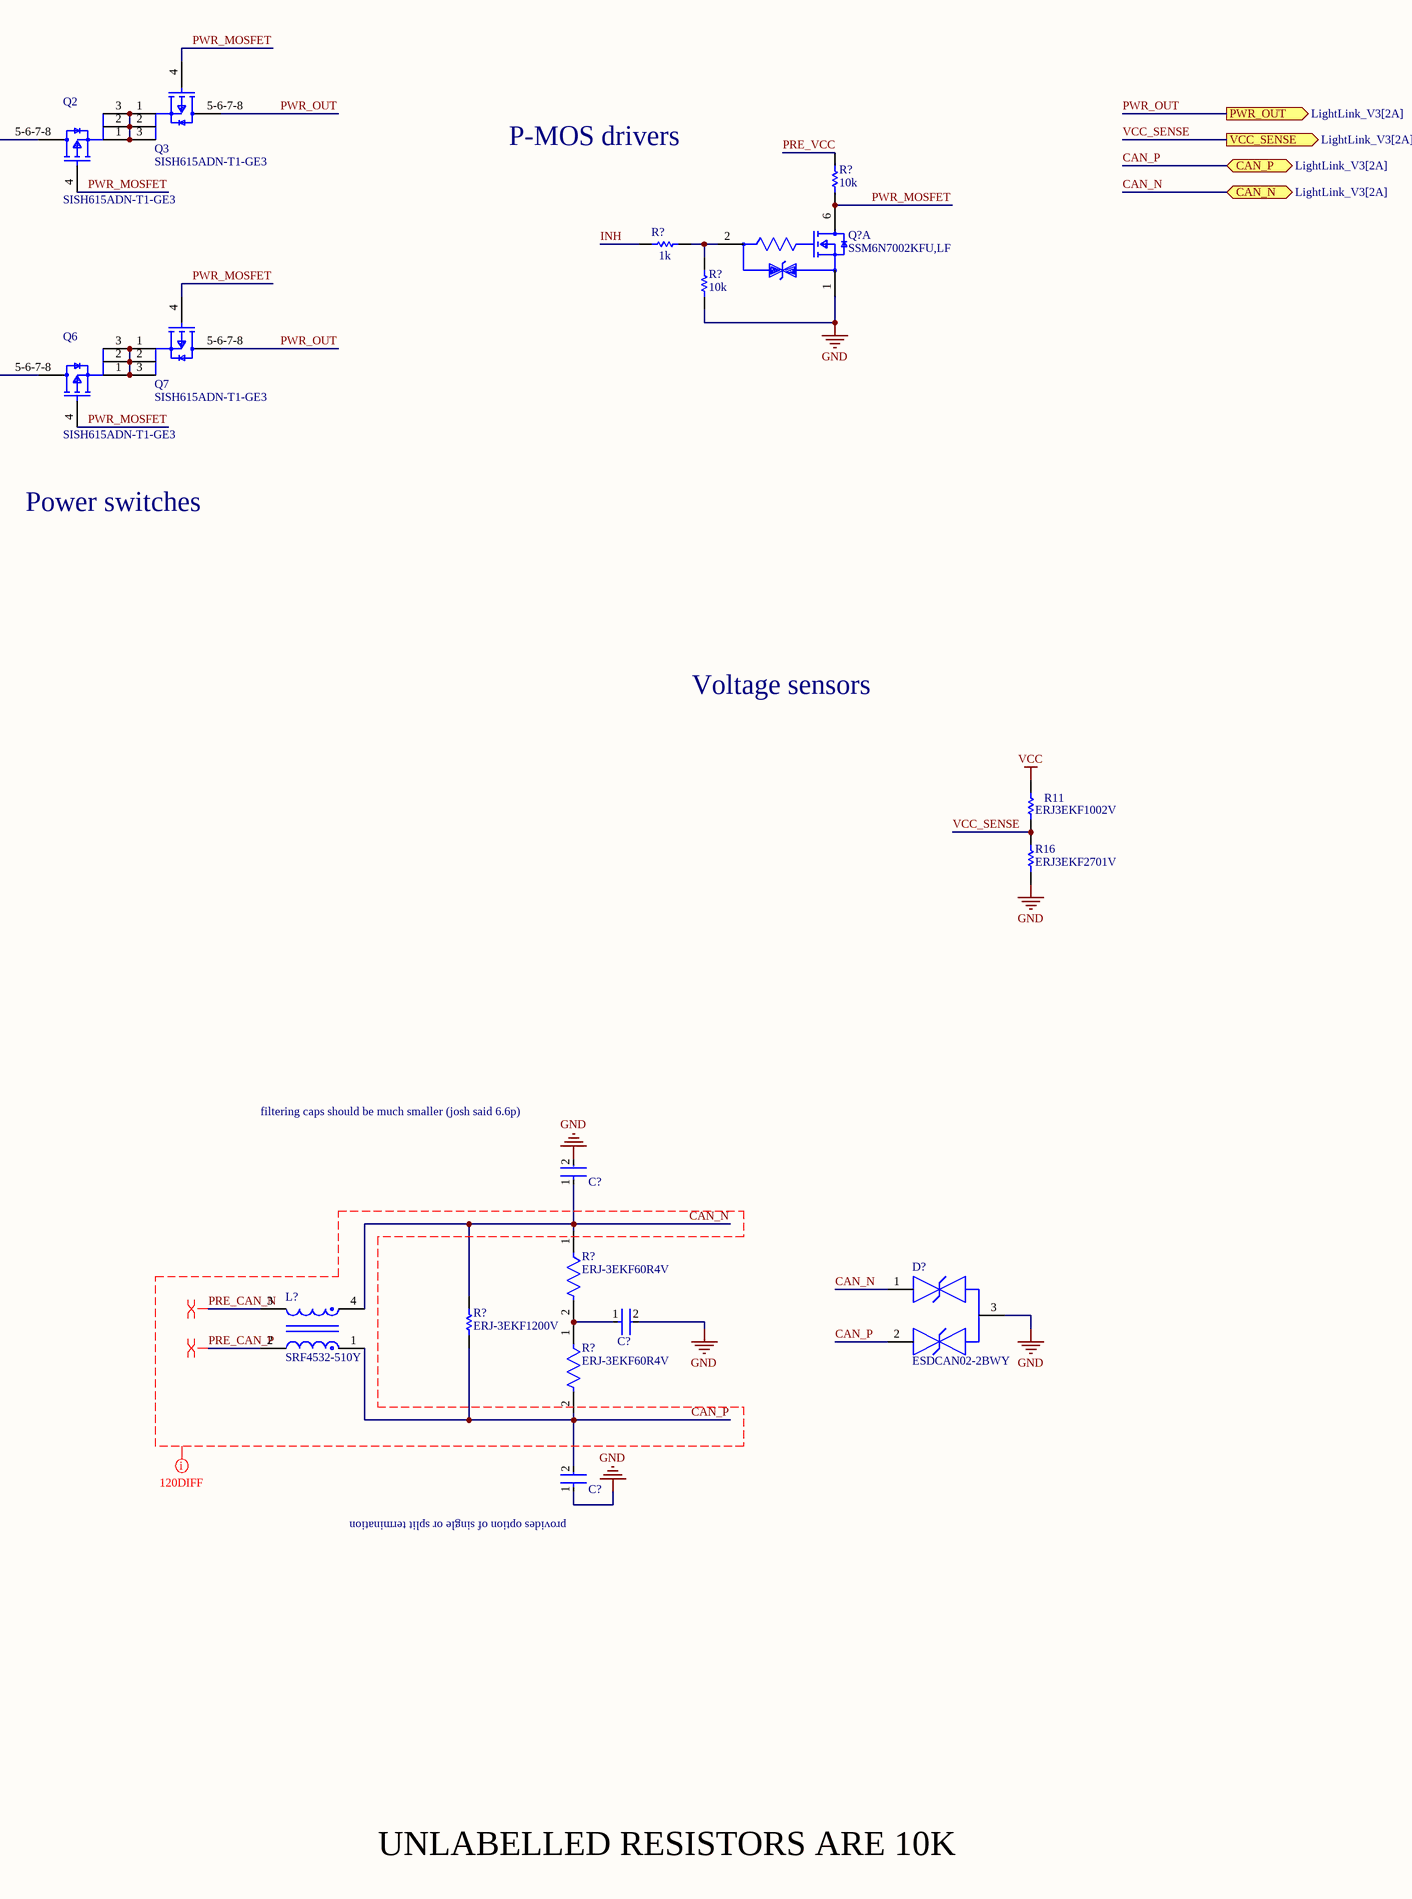
[diagram p4: TCAN1146_PWR_MGMT.SchDoc, right]

### Parts
(Parts that share a designator on the sheet are numbered #1, #2 ... from top to bottom, then left to right.)
C?#23  C0402C104K8PACTU  [FP-C0402-BB-MFG]  (value not drawn)
C?#24  C0402C104K8PACTU  [FP-C0402-BB-MFG]  (value not drawn)
C?#25  C0402C104K8PACTU  [FP-C0402-BB-MFG]  (value not drawn)
C?#26  C0402C104K8PACTU  [FP-C0402-BB-MFG]  (value not drawn)
C?#27  C0402C104K8PACTU  [FP-C0402-BB-MFG]  (value not drawn)
C?#28  C0402C104K8PACTU  [FP-C0402-BB-MFG]  (value not drawn)
C?#29  C0402C104K8PACTU  [FP-C0402-BB-MFG]  (value not drawn)
C?#30  C0805C225K9PACTU  [CAPC2013X145X50ML20T25]
C?#31  C0402C104K8PACTU  [FP-C0402-BB-MFG]  (value not drawn)
D1  MMSZ5242BT1G  [ONSC-SOD-123-2-425-04_V]
D?#3  1N4148W-TP  [FP-SOD-123-IPC_A]
D?#4  ESDCAN02-2BWY  [FP-SOT323-3L-MFG]
F1  0679L9100-05  [FP-0679L-MFG]
L?  SRF4532-510Y  [FP-SRF4532-MFG]
Q1  SISH615ADN-T1-GE3  [SISH615ADN-T1-GE3-Footprint-1]
Q2  SISH615ADN-T1-GE3  [SISH615ADN-T1-GE3-Footprint-1]
Q3  SISH615ADN-T1-GE3  [SISH615ADN-T1-GE3-Footprint-1]
Q4  SISH615ADN-T1-GE3  [SISH615ADN-T1-GE3-Footprint-1]
Q6  SISH615ADN-T1-GE3  [SISH615ADN-T1-GE3-Footprint-1]
Q7  SISH615ADN-T1-GE3  [SISH615ADN-T1-GE3-Footprint-1]
Q?  SSM6N7002KFU,LF  [FP-SSOP6-P-0_65A-MFG]  (part A of 2)
R4  ERJ3EKF1002V  [RESC1609X55X30LL15T15]  (value not drawn)
R11  ERJ3EKF1002V  [RESC1609X55X30LL15T15]
R16  ERJ3EKF2701V  [RESC1608X55X30LL15T15]
R?#10  10k  [R0805A]
R?#11  1k  [R0805A]
R?#12  10k  [R0805A]
R?#13  ERJ3EKF1002V  [RESC1609X55X30LL15T15]  (value not drawn)
R?#14  ERJ-3EKF60R4V  [FP-ERJ3EK-IPC_C]
R?#15  ERJ-3EKF1001V  [RESC1608X55X30LL15T15]
R?#16  ERJ-3EKF1200V  [RESC1609X55X30ML15T15]
R?#17  ERJ-3EKF60R4V  [FP-ERJ3EK-IPC_C]
R?#18  ERJ3EKF1002V  [RESC1609X55X30LL15T15]
R?#19  ERJ3EKF1002V  [RESC1609X55X30LL15T15]
SW?  KXT331LHS  [FP-KXT331LHS-MFG]
U?#1  TCAN1146DYYRQ1  [TCAN1146DYYRQ1-Footprint-1]
U?#2  AP7381-50Y-13  [FP-SOT89-MFG]

### Ports
CAN_MISO (out, see LightLink_V3[2A]), CAN_MOSI (in, see LightLink_V3[2A]), CAN_N (bidir, see LightLink_V3[2A]), CAN_nCS (in, see LightLink_V3[2A]), CAN_P (bidir, see LightLink_V3[2A]), CAN_RX (bidir, see LightLink_V3[2A]), CAN_SCLK (in, see LightLink_V3[2A]), CAN_TX (bidir, see LightLink_V3[2A]), PWR_IN (in, see LightLink_V3[2A]), PWR_OUT (out, see LightLink_V3[2A]), VCC_SENSE (out, see LightLink_V3[2A])

### Nets
3V3: C?#25.2 U?#1.5(VIO)
5V: C?#24.2 C?#30.2 R?#18.2 U?#1.3(VCC) U?#2.1(VOUT)
GND: C?#23.2 C?#24.1 C?#25.1 C?#26.1 C?#27.2 C?#28.1 C?#29.1 C?#30.1 C?#31.1 D?#4.3 Q?.1(Source1) R4.2 R16.1 R?#12.1 R?#19.2 SW?.1 U?#1.2(GND) U?#2.2(GND)
PWR_IN: F1.1 ; port PWR_IN
PWR_OUT: C?#31.2 Q3.5-6-7-8(D) Q7.5-6-7-8(D) R11.1 U?#2.3(VIN) ; port PWR_OUT  [also labelled VCC]  [project net PWR_IN]
CAN_INH: U?#1.7(INH/LIMP)
CAN_MISO: U?#1.6(nINT/SDO) ; port CAN_MISO
CAN_MOSI: U?#1.11(SDI) ; port CAN_MOSI
CAN_N: C?#23.1 D?#4.1 L?.4 R?#14.1 R?#16.1 ; port CAN_N
CAN_nCS: U?#1.14(nCS) ; port CAN_nCS
CAN_P: C?#29.2 D?#4.2 L?.1 R?#16.2 R?#17.2 ; port CAN_P
CAN_RX: U?#1.4(RXD) ; port CAN_RX
CAN_SCLK: U?#1.8(SCLK) ; port CAN_SCLK
CAN_TX: U?#1.1(TXD) ; port CAN_TX
CAN_VSUP: D?#3.2(A)
INH: R?#11.1
INT_5V_SENSE: R?#18.1 R?#19.1
PRE_CAN_N: L?.3 U?#1.12(CANL)
PRE_CAN_P: L?.2 U?#1.13(CANH)
PRE_VCC: D1.1(K) Q1.1(S) Q1.2(S) Q1.3(S) Q2.5-6-7-8(D) Q4.1(S) Q4.2(S) Q4.3(S) Q6.5-6-7-8(D) R?#10.2
PWR_MOSFET: Q2.4(G) Q3.4(G) Q6.4(G) Q7.4(G) Q?.6(Drain1) R?#10.1
RP_MOS_LINK: D1.2(A) Q1.4(G) Q4.4(G) R4.1
VCC_SENSE: R11.2 R16.2 ; port VCC_SENSE
NetC?#26_2: C?#26.2 D?#3.1(C) R?#13.1 U?#1.10(VSUP)
NetC?#27_1: C?#27.1 R?#14.2 R?#17.1
NetC?#28_2: C?#28.2 R?#13.2 R?#15.2 SW?.2
NetF1_2: F1.2 Q1.5-6-7-8(D) Q4.5-6-7-8(D)
NetQ2_1: Q2.1(S) Q2.2(S) Q2.3(S) Q3.1(S) Q3.2(S) Q3.3(S)
NetQ6_1: Q6.1(S) Q6.2(S) Q6.3(S) Q7.1(S) Q7.2(S) Q7.3(S)
NetQ?_2: Q?.2(Gate1) R?#11.2 R?#12.2
NetR?#15_1: R?#15.1 U?#1.9(WAKE)

### Layout directives
differential pair: PRE_CAN_N, PRE_CAN_P
net class 120DIFF: CAN_N, CAN_P, PRE_CAN_N, PRE_CAN_P

### Notes on the sheet
- P-MOS drivers
- (near F1) 10A FUSE
- Reverse polarity protection
- Power switches
- Voltage sensors
- CAN INTERFACE
- (near C?#23) filtering caps should be much smaller (josh said 6.6p)
- (near U?#1) Multiple CAN_INH pulldowns in PWR_MGMT
- (near SW?) WAKE SWITCH
- CAN_INH GOES TO V_SUP - OK ON THIS BOARD
- (near C?#29) provides option of single or split termination
- UNLABELLED RESISTORS ARE 10K

### Library data of the parts
C?#23-C?#29 C?#31 = CMP-2008-02046-2: CAP CER 0.1UF 10V X5R 0402; Manufacturer: Kemet; Material: Ceramic; Capacitance: 0.10 μF; Temperature Coefficient: 15%; Tolerance: 0.1; Value: 0.10 μF; Package: C0402-BB; Temperature: -55°C to +125°C; ComponentLink2Description: Datasheet; Temperature Characteristic: X5R; Device Class L1: Passive Components; Height: 0.55mm; Lead Free: Yes; ComponentLink2URL: https://content.kemet.com/datasheets/KEM_C1002_X7R_SMD.pdf; Device Class L2: Capacitors; Temperature Range Low: -55°C; Temperature Range High: +125°C; RoHS: TRUE; Octopart: https://octopart.com/c0402c104k8pactu-kemet-140039; Automotive: No; Mouser Description: Capacitor 100 nF 10 VDC 0402; Category: Cap; Voltage Rating: 10 V; Digikey Description: CAP CER 0.1UF 10V X5R 0402; Ipc Land Pattern Name: CAPC10050X50; Device Class L3: Ceramic Capacitors; Manufacturer Part Number: C0402C104K8PACTU
C?#30 = CMP-1036-04819-2: Manufacturer: Kemet; Part Number: C0805C225K9PACTU
D1 = CMP-1060-00565-1: Zener Voltage Regulator, 500 mW, 2-Pin SOD-123, Pb-Free, Tape and Reel; Manufacturer: On Semiconductor; P Max (W): 0.5; VZ Typ (V): 12; PartNumber: MMSZ5242BT1G; PackageReference: SOD-123-2-425-04; ComponentLink3URL: http://www.onsemi.com/pub_link/Collateral/425-04.PDF; Mounting Technology: Surface Mount; ComponentLink2Description: Datasheet; ComponentLink1URL: http://www.onsemi.com/; ComponentLink3Description: Package Specification; PackageDescription: 2-Pin SOD, Body 1.6 x 2.69 mm; PackageVersion: Rev. G, 10/2009; ComponentLink1Description: Manufacturer URL; RoHS: Pb-Free; ComponentLink2URL: http://www.onsemi.com/pub_link/Collateral/MMSZ5221BT1-D.PDF; Packing: Tape and Reel; DatasheetVersion: Rev. 12
D?#3 = CMP-2000-04993-2: DIODE GEN PURP 100V 150MA SOD123; Max Reverse Leakage Current: 5uA; Max Surge Current: 2A; Reverse Recovery Time: 4ns; Polarity: Standard; Capacitance: 4pF; Max Forward Surge Current (Ifsm): 1A; Element Configuration: Single; Power Dissipation: 400mW; Forward Voltage: 1V; Radiation Hardening: No; Lead Free: Lead Free; Max Reverse Voltage (DC): 100V; Current Rating: 150mA; Forward Current: 150mA; Packaging: Tape and Reel; Number of Pins: 2; Package Quantity: 3000; Max Operating Temperature: 150°C; Min Operating Temperature: -65°C; Average Rectified Current: 150mA; Recovery Time: 4ns; Output Current: 150mA; Peak Non-Repetitive Surge Current: 2A; Width: 1.8mm; Voltage Rating (DC): 100V; Height: 1.2mm; Max Repetitive Reverse Voltage (Vrrm): 100V; Mount: Surface Mount; Length: 2.85mm
D?#4 = CMP-12225-000055-1: TVS DIODE 26.5V 44V SOT323-3; Manufacturer: STMicroelectronics; Value: 3pF; Direction: Bidirectional; Breakdown Voltage: 28.5V; Automotive Grade: Grade 0; Standoff Height: 0mm; Peak Pulse Power: 170W; Peak Pulse Current: 3A; Number Of Channels: 2; Max Junction Temp: +175°C; Mouser Description: TVS Diodes / ESD Suppressors Automotive dual-line Transil, Transient voltage suppressor (TVS) for CAN bus; Height: 1.1mm; Category: Diode; Reverse Standoff Voltage: 26.5V; Device Class L1: Circuit Protection; Temperature: -55°C to +175°C; RoHS: TRUE; ComponentLink2URL: https://www.st.com/resource/en/datasheet/esdcan02-2bwy.pdf; Device Class L3: unset; Device Class L2: TVS Diodes; Temperature Range High: +175°C; Octopart: https://octopart.com/esdcan02-2bwy-stmicroelectronics-58631133; Ipc Land Pattern Name: SOT65P210X95-3; Temperature Range Low: -55°C; Capacitance: 3pF; Digikey Description: TVS DIODE 26.5V 44V SOT323-3; Automotive: Yes; ComponentLink2Description: Datasheet; Clamping Voltage: 44V; Manufacturer Part Number: ESDCAN02-2BWY; Lead Free: Yes; Package: SOT323-3L
F1 = CMP-16042-000002-1: DIFF P#!!! / FUSE BRD MNT 10A 125VAC/VDC; Manufacturer: Bel Fuse; Manufacturer Part Number: 0679L9150-01; Max Fuse Ac Voltage: 125V; Fuse Blow Speed: Fast; Fuse Current: 15A; Fuse I2T: 103.5A2Sec; Fuse Interrupt Ac Current: 50A; Automotive Grade: Grade 1; Value: 0.0038Ω; Fuse Interrupt Dc Current: 300A; Fuse Voltage Drop: 0.13V; Device Class L2: Fuses; ComponentLink2URL: https://www.belfuse.com/resources/CircuitProtection/datasheets/0679L%20Sep2016.pdf; Package: 0679L; Height: 2.79mm; Digikey Description: FUSE BRD MNT 15A 125VAC/VDC; Temperature Range High: +125°C; Device Class L3: unset; Octopart: https://octopart.com/0679l9150-01-bel+fuse-70850665; Temperature Range Low: -55°C; Max Fuse Dc Voltage: 125V; Ipc Land Pattern Name: CAPC610254X254; Category: Fuse; Lead Free: Yes; Automotive: Yes; Resistance: 0.0038Ω; RoHS: TRUE; Device Class L1: Circuit Protection; ComponentLink2Description: Datasheet; Temperature: -55°C to +125°C; Voltage Rating: 125V
L? = CMP-07251-000006-1: CMC 51UH 200MA 2LN 2KOHM SMD; Element Configuration: Dual; Number of Lines: 2; Core Material: Ferrite; Impedance: 2kR; Test Frequency: 100kHz; Voltage Rating (DC): 50V; Insulation Resistance: 10MR; Material: Steel; Tolerance: 50%; DC Resistance (DCR): 3.5R; RoHS Compliant: Yes; Mount: Surface Mount; REACH SVHC: No SVHC; Termination: SMD/SMT; DC Current: 200mA; Current: 200mA; Lead Free: Lead Free; Contact Plating: Tin; Length: 4.5mm; Max DC Current: 200mA; Width: 0.126inch; Case/Package: 4532; Packaging: Tape and Reel; Package Quantity: 1; Min Operating Temperature: -40°C; Depth: 3.4mm; Series: SRF4532; Max Operating Temperature: 125°C; Current Rating: 200mA; Self Resonant Frequency: 100kHz; Height: 0.118inch; Inductance: 51uH; Resistance: 2kR
Q1-Q4 Q6 Q7 = CMP-013-00036-2: Trans MOSFET P-CH 20V 22.1A 8-Pin PowerPAK 1212 EP T/R
Q? = CMP-35916-000009-1: MOSFET 2N-CH 60V 0.3A; Input Capacitance: 40pF; Continuous Drain Current (ID): 300mA; Max Power Dissipation: 285mW; FET Type: 2 N-Channel; Rds On Max: 1.5R; Mount: Surface Mount; Drain to Source Voltage (Vdss): 60V; Packaging: Tape and Reel
R4 R11 R?#13 R?#18 R?#19 = CMP-1012-00623-3: Chip Resistor, 10 KOhm, +/- 1%, 0.1 W, -55 to 155 degC, 0603 (1608 Metric), RoHS, Tape and Reel; Manufacturer: Panasonic; Voltage Rating: 75V; Case\/Package: 0603; Power Rating: 100mW; Resistance: 10KOhm; Temperature Coefficient: 100ppm\/degreesC; Number of Pins: 2; Package Reference: 603; Depth: 0.8mm; Mount: SurfaceMount; Package Description: 2-Pin Surface Mount Device, Body 1.6 x 0.85 mm; Datasheet Version: 02/2017; Length: 1.6mm; Lead Free: LeadFree; Height: 0.45mm; Number of Terminations: 2; Max Power Dissipation: 100mW; Min Operating Temperature: -55degC; Datasheet URL: https://industrial.panasonic.com/cdbs/www-data/pdf/RDA0000/AOA0000C304.pdf; Termination: SMD/SMT; Case Code (Metric): 1608; Case Code (Imperial): 0603; Tolerance: 1%; Max Operating Temperature: 155degC; RoHSCompliant: true; Voltage Rating (DC): 75V; Radiation Hardening: No; Packaging: TapeandReel; Composition: ThickFilm; Mounting Technology: SurfaceMount; Manufacturer URL: http://www.panasonic.com/; Width: 0.031inch; REACH SVHC: NoSVHC; Contact Plating: Tin; Military Standard: Not; Package Quantity: 1
R16 = CMP-2000-00389-1: Manufacturer: Panasonic; Part Number: ERJ3EKF2701V
R?#10-R?#12 = CMP-009-00002-14: Resistor
R?#14 R?#17 = CMP-1012-00372-3: RES SMD 60.4 OHM 1% 1/10W 0603; Resistance: 60.4R; Voltage Rating (DC): 50V; Voltage Rating: 75V; Temperature Coefficient: 100ppm/°C; Power Rating: 100mW; Mount: Surface Mount; Number of Terminations: 2; Max Operating Temperature: 155°C; Case Code (Metric): 1608; Height: 0.022inch; Case/Package: 0603; Min Operating Temperature: -55°C; REACH SVHC: No SVHC; Series: ERJ; Features: Automotive AEC-Q200; Military Standard: Not; Lead Free: Lead Free; Width: 0.031inch; Case Code (Imperial): 0603; Resistance Tolerance: 1%; Packaging: Tape and Reel; Termination: SMD/SMT; Tolerance: 1%; Contact Plating: Tin; Depth: 0.8mm; Resistor Type: Thick Film; Construction: Rectangular; RoHS Compliant: Yes; Max Power Dissipation: 100mW; Package Quantity: 1; Length: 1.6mm
R?#15 = CMP-2000-00180-1: Manufacturer: Panasonic; Part Number: ERJ-3EKF1001V
R?#16 = CMP-2000-00213-2: Chip Resistor, 120 Ohm, +/- 1%, 0.1 W, -55 to 155 degC, 0603 (1608 Metric), RoHS, Tape and Reel; Manufacturer: Panasonic; Power Rating: 100mW; Voltage Rating (DC): 75V; Resistance: 120Ohm; Temperature Coefficient: 100ppm/degreesC; Number of Terminations: 2; Military Standard: Not; Tolerance: 1%; Min Operating Temperature: -55degC; Packaging: TapeandReel; Lead Free: LeadFree; Max Operating Temperature: 155degC; Manufacturer URL: http://www.panasonic.com/; Case Code (Imperial): 0603; REACH SVHC: NoSVHC; Width: 0.031inch; Datasheet URL: https://industrial.panasonic.com/cdbs/www-data/pdf/RDA0000/AOA0000C283.pdf; RoHSCompliant: true; Max Power Dissipation: 100mW; Termination: SMD/SMT; Package Reference: 0603; Height: 0.022inch; Depth: 0.8mm; Package Description: 2-Pin Surface Mount Device, Body 1.6 x 0.85 mm; Contact Plating: Tin; Length: 1.6mm; Package URL: http://www.st.com/st-web-ui/static/active/en/resource/technical/document/datasheet/CD00001320.pdf; Radiation Hardening: No; Package Quantity: 1; Number of Pins: 2; Datasheet Version: 42095.0; Voltage Rating: 75V; Composition: ThickFilm; Case/Package: 0603; Mount: SurfaceMount; Case Code (Metric): 1608
SW? = CMP-10040-000029-1: as SW1 on sheet STM32H730_PINOUT; Contact Plating: Gold; Insulation Color: Black; Min Operating Temperature: -40°C; Packaging: Tape and Reel; Flammability Rating: UL94 V-0; Max Operating Temperature: 85°C; Termination: Solder; Mount: Surface Mount
U?#1 = CMP-015-00012-2: Automotive CAN FD transceiver with watchdog, bus diagnostics and partial networking via sele 14-SOT-23-THIN -40 to 150
U?#2 = CMP-12756-000009-1: IC REG LINEAR 5V 150MA SOT89; Manufacturer: Diodes Inc.; Output Type: Fixed; Min Supply Voltage: 3.3V; Max Junction Temp: +125°C; Max Supply Voltage: 40V; Nominal Supply Current: 2.5-25uA; Number Of Outputs: 1; Dropout Voltage: 1000mV; Manufacturer Part Number: AP7381-50Y-13; RoHS: TRUE; Digikey Description: IC REG LINEAR 5V 150MA SOT89; Output Voltage: 5V; Footprint Url: https://www.diodes.com/assets/Package-Files/SOT89.pdf; Category: IC; Temperature: -40°C to +125°C; ComponentLink2Description: Datasheet; Package: SOT89; Temperature Range Low: -40°C; Temperature Range High: +125°C; ComponentLink2URL: https://www.diodes.com/assets/Datasheets/AP7381.pdf; Device Class L1: Integrated Circuits (ICs); Automotive: No; Output Current: 150mA; Ambient Temperature Range High: +85°C; Octopart: https://octopart.com/ap7381-50y-13-diodes+inc.-87775116; Lead Free: Yes; Device Class L2: Power Management ICs; Height: 1.6mm; Device Class L3: Voltage Regulators - Linear; Ambient Temperature Range Low: -40°C

## Sheet MOSFET_BANK.SchDoc
size C; SheetNumber: 2; SheetTotal: 9
Used 4 times, as channels MOSFET_BANK_0, MOSFET_BANK_1, MOSFET_BANK_2, MOSFET_BANK_3. Parts and nets are listed once, with the designators drawn on the sheet.
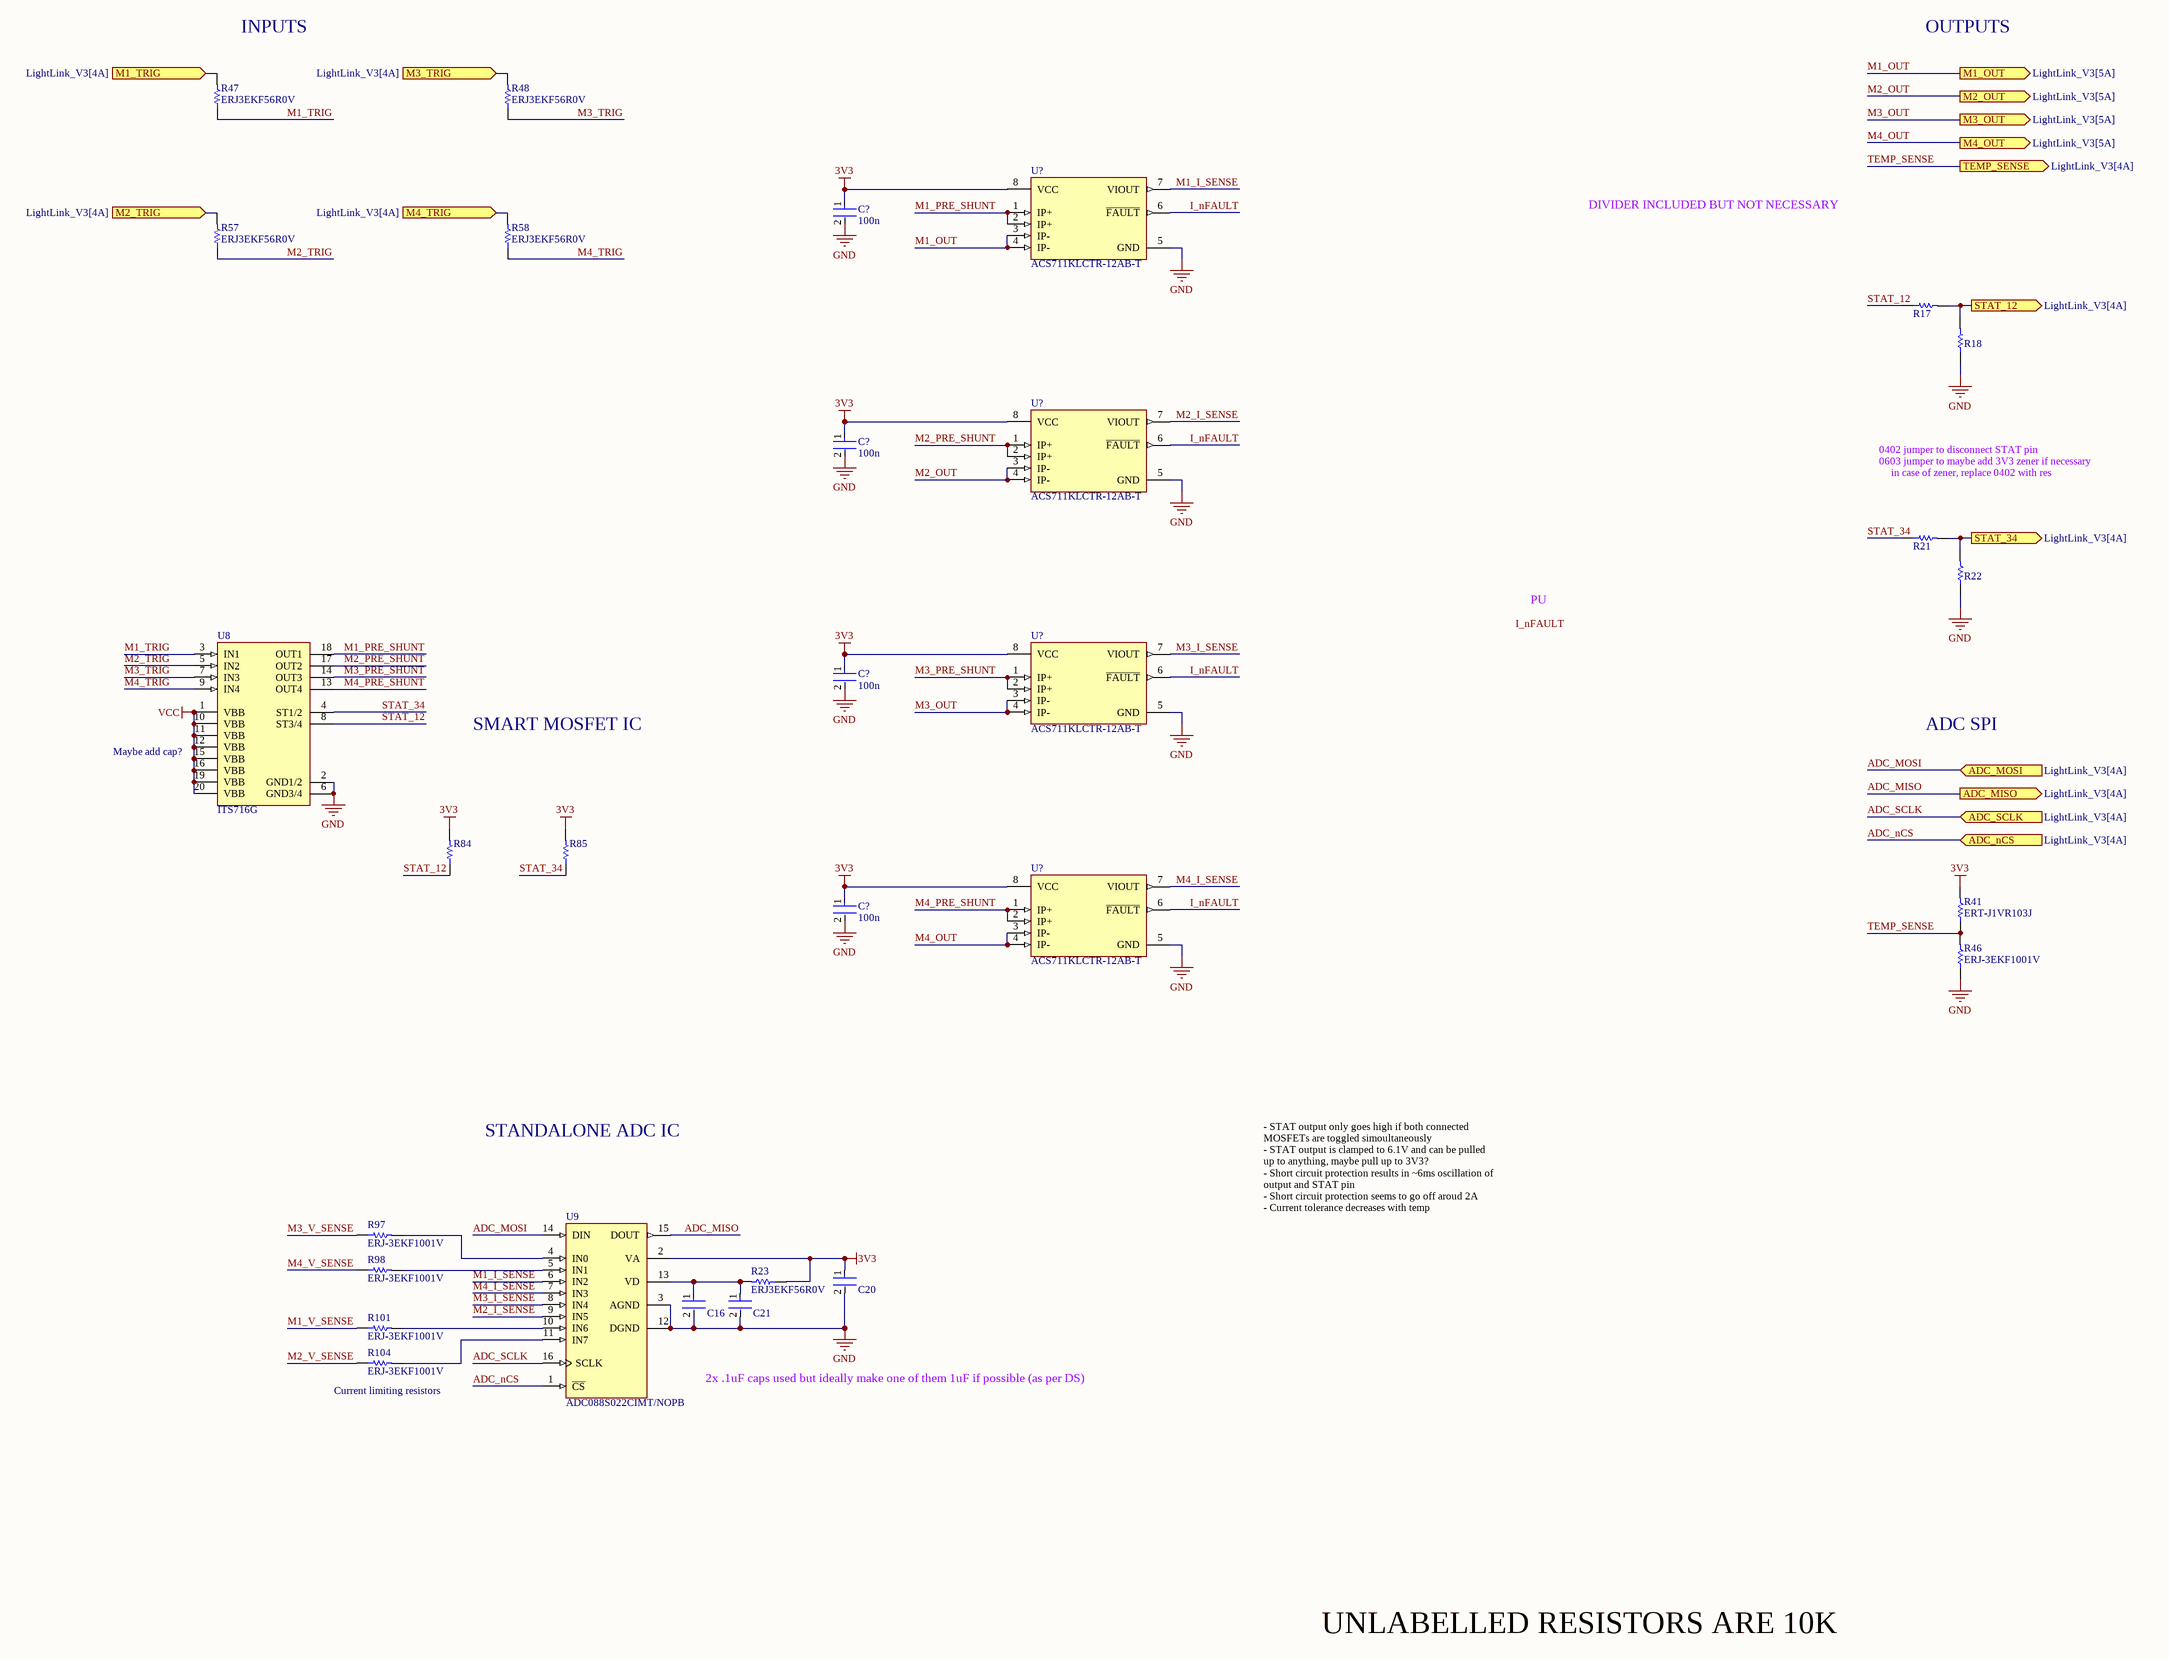
[diagram p5: MOSFET_BANK.SchDoc]

### Parts
(Parts that share a designator on the sheet are numbered #1, #2 ... from top to bottom, then left to right.)
C16  C0402C104K8PACTU  [FP-C0402-BB-MFG]  (value not drawn)
C20  C0402C104K8PACTU  [FP-C0402-BB-MFG]  (value not drawn)
C21  C0402C104K8PACTU  [FP-C0402-BB-MFG]  (value not drawn)
C?#1  100n  [FP-0402-L_1_0_0_05-W_0_5-IPC_A]
C?#2  100n  [FP-0402-L_1_0_0_05-W_0_5-IPC_A]
C?#3  100n  [FP-0402-L_1_0_0_05-W_0_5-IPC_A]
C?#4  100n  [FP-0402-L_1_0_0_05-W_0_5-IPC_A]
R17  0402 JUMPER 0 OHM  [RESC1005X40X25NL05T05]  (value not drawn)
R18  0603 JUMPER  [RESC1609X55X30ML15T15]  (value not drawn)
R21  0402 JUMPER 0 OHM  [RESC1005X40X25NL05T05]  (value not drawn)
R22  0603 JUMPER  [RESC1609X55X30ML15T15]  (value not drawn)
R23  ERJ3EKF56R0V  [RESC1608X55X30NL15T15]
R41  ERT-J1VR103J  [RESC1608X90X30ML15T20]
R46  ERJ-3EKF1001V  [RESC1608X55X30LL15T15]
R47  ERJ3EKF56R0V  [RESC1608X55X30NL15T15]
R48  ERJ3EKF56R0V  [RESC1608X55X30NL15T15]
R57  ERJ3EKF56R0V  [RESC1608X55X30NL15T15]
R58  ERJ3EKF56R0V  [RESC1608X55X30NL15T15]
R84  ERJ3EKF1002V  [RESC1609X55X30LL15T15]  (value not drawn)
R85  ERJ3EKF1002V  [RESC1609X55X30LL15T15]  (value not drawn)
R97  ERJ-3EKF1001V  [RESC1608X55X30LL15T15]
R98  ERJ-3EKF1001V  [RESC1608X55X30LL15T15]
R101  ERJ-3EKF1001V  [RESC1608X55X30LL15T15]
R104  ERJ-3EKF1001V  [RESC1608X55X30LL15T15]
U8  ITS716G  [INF-PG-DSO-20-32_L]
U9  ADC088S022CIMT/NOPB  [MTC16_L]
U?#1  ACS711KLCTR-12AB-T  [FP-LC-8-IPC_C]
U?#2  ACS711KLCTR-12AB-T  [FP-LC-8-IPC_C]
U?#3  ACS711KLCTR-12AB-T  [FP-LC-8-IPC_C]
U?#4  ACS711KLCTR-12AB-T  [FP-LC-8-IPC_C]

### Ports
ADC_MISO (out, see LightLink_V3[4A]), ADC_MOSI (in, see LightLink_V3[4A]), ADC_nCS (in, see LightLink_V3[4A]), ADC_SCLK (in, see LightLink_V3[4A]), M1_OUT (out, see LightLink_V3[5A]), M1_TRIG (in, see LightLink_V3[4A]), M2_OUT (out, see LightLink_V3[5A]), M2_TRIG (in, see LightLink_V3[4A]), M3_OUT (out, see LightLink_V3[5A]), M3_TRIG (in, see LightLink_V3[4A]), M4_OUT (out, see LightLink_V3[5A]), M4_TRIG (in, see LightLink_V3[4A]), STAT_12 (out, see LightLink_V3[4A]), STAT_34 (out, see LightLink_V3[4A]), TEMP_SENSE (out, see LightLink_V3[4A])

### Nets
3V3: C20.1 C?#1.1 C?#2.1 C?#3.1 C?#4.1 R23.1 R41.2 R84.2 R85.2 U9.2(VA) U?#1.8(VCC) U?#2.8(VCC) U?#3.8(VCC) U?#4.8(VCC)
GND: C16.2 C20.2 C21.2 C?#1.2 C?#2.2 C?#3.2 C?#4.2 R18.1 R22.1 R46.1 U8.2(GND1/2) U8.6(GND3/4) U9.3(AGND) U9.12(DGND) U?#1.5(GND) U?#2.5(GND) U?#3.5(GND) U?#4.5(GND)
VCC: U8.1(VBB) U8.10(VBB) U8.11(VBB) U8.12(VBB) U8.15(VBB) U8.16(VBB) U8.19(VBB) U8.20(VBB)
ADC_MISO: U9.15(DOUT) ; port ADC_MISO
ADC_MOSI: U9.14(DIN) ; port ADC_MOSI
ADC_nCS: U9.1(~{CS}) ; port ADC_nCS
ADC_SCLK: U9.16(SCLK) ; port ADC_SCLK
I_nFAULT: U?#1.6(~{FAULT}) U?#2.6(~{FAULT}) U?#3.6(~{FAULT}) U?#4.6(~{FAULT})
M1_I_SENSE: U9.6(IN2) U?#1.7(VIOUT)
M1_OUT: U?#1.3(IP-) U?#1.4(IP-) ; port M1_OUT
M1_PRE_SHUNT: U8.18(OUT1) U?#1.1(IP+) U?#1.2(IP+)
M1_TRIG: R47.1 U8.3(IN1)
M1_TRIG: R47.2 ; port M1_TRIG  [a separate net that carries the same name]
M1_V_SENSE: R101.1
M2_I_SENSE: U9.9(IN5) U?#2.7(VIOUT)
M2_OUT: U?#2.3(IP-) U?#2.4(IP-) ; port M2_OUT
M2_PRE_SHUNT: U8.17(OUT2) U?#2.1(IP+) U?#2.2(IP+)
M2_TRIG: R57.1 U8.5(IN2)
M2_TRIG: R57.2 ; port M2_TRIG  [a separate net that carries the same name]
M2_V_SENSE: R104.1
M3_I_SENSE: U9.8(IN4) U?#3.7(VIOUT)
M3_OUT: U?#3.3(IP-) U?#3.4(IP-) ; port M3_OUT
M3_PRE_SHUNT: U8.14(OUT3) U?#3.1(IP+) U?#3.2(IP+)
M3_TRIG: R48.1 U8.7(IN3)
M3_TRIG: R48.2 ; port M3_TRIG  [a separate net that carries the same name]
M3_V_SENSE: R97.1
M4_I_SENSE: U9.7(IN3) U?#4.7(VIOUT)
M4_OUT: U?#4.3(IP-) U?#4.4(IP-) ; port M4_OUT
M4_PRE_SHUNT: U8.13(OUT4) U?#4.1(IP+) U?#4.2(IP+)
M4_TRIG: R58.1 U8.9(IN4)
M4_TRIG: R58.2 ; port M4_TRIG  [a separate net that carries the same name]
M4_V_SENSE: R98.1
STAT_12: R17.1 R84.1 U8.8(ST3/4)
STAT_12: R17.2 R18.2 ; port STAT_12  [a separate net that carries the same name]
STAT_34: R21.1 R85.1 U8.4(ST1/2)
STAT_34: R21.2 R22.2 ; port STAT_34  [a separate net that carries the same name]
TEMP_SENSE: R41.1 R46.2 ; port TEMP_SENSE
NetC16_1: C16.1 C21.1 R23.2 U9.13(VD)
NetR97_2: R97.2 U9.4(IN0)
NetR98_2: R98.2 U9.5(IN1)
NetR101_2: R101.2 U9.10(IN6)
NetR104_2: R104.2 U9.11(IN7)

### Channels
MOSFET_BANK_0: designators C16=C16_MOSFET_BANK_0 C20=C20_MOSFET_BANK_0 C21=C21_MOSFET_BANK_0 C?=C?_MOSFET_BANK_0#1 C?=C?_MOSFET_BANK_0#2 C?=C?_MOSFET_BANK_0#3 C?=C?_MOSFET_BANK_0#4 R17=R17_MOSFET_BANK_0 R18=R18_MOSFET_BANK_0 R21=R21_MOSFET_BANK_0 R22=R22_MOSFET_BANK_0 R23=R23_MOSFET_BANK_0 R41=R41_MOSFET_BANK_0 R46=R46_MOSFET_BANK_0 R47=R47_MOSFET_BANK_0 R48=R48_MOSFET_BANK_0 R57=R57_MOSFET_BANK_0 R58=R58_MOSFET_BANK_0 R84=R84_MOSFET_BANK_0 R85=R85_MOSFET_BANK_0 R97=R97_MOSFET_BANK_0 R98=R98_MOSFET_BANK_0 R101=R101_MOSFET_BANK_0 R104=R104_MOSFET_BANK_0 U8=U8_MOSFET_BANK_0 U9=U9_MOSFET_BANK_0 U?=U?_MOSFET_BANK_0#1 U?=U?_MOSFET_BANK_0#2 U?=U?_MOSFET_BANK_0#3 U?=U?_MOSFET_BANK_0#4; ports ADC_MISO=ADC_MISO ADC_MOSI=ADC_MOSI ADC_nCS=ADC_nCS_MOSFET_BANK_0 ADC_SCLK=ADC_SCLK M1_OUT=M1_OUT M1_TRIG=NetR47_MOSFET_BANK_0_2 M2_OUT=M2_OUT M2_TRIG=NetR57_MOSFET_BANK_0_2 M3_OUT=M3_OUT M3_TRIG=NetR48_MOSFET_BANK_0_2 M4_OUT=M4_OUT M4_TRIG=NetR58_MOSFET_BANK_0_2 STAT_12=NetR17_MOSFET_BANK_0_2 STAT_34=NetR21_MOSFET_BANK_0_2 TEMP_SENSE=TEMP_SENSE_MOSFET_BANK_0
MOSFET_BANK_1: designators C16=C16_MOSFET_BANK_1 C20=C20_MOSFET_BANK_1 C21=C21_MOSFET_BANK_1 C?=C?_MOSFET_BANK_1#1 C?=C?_MOSFET_BANK_1#2 C?=C?_MOSFET_BANK_1#3 C?=C?_MOSFET_BANK_1#4 R17=R17_MOSFET_BANK_1 R18=R18_MOSFET_BANK_1 R21=R21_MOSFET_BANK_1 R22=R22_MOSFET_BANK_1 R23=R23_MOSFET_BANK_1 R41=R41_MOSFET_BANK_1 R46=R46_MOSFET_BANK_1 R47=R47_MOSFET_BANK_1 R48=R48_MOSFET_BANK_1 R57=R57_MOSFET_BANK_1 R58=R58_MOSFET_BANK_1 R84=R84_MOSFET_BANK_1 R85=R85_MOSFET_BANK_1 R97=R97_MOSFET_BANK_1 R98=R98_MOSFET_BANK_1 R101=R101_MOSFET_BANK_1 R104=R104_MOSFET_BANK_1 U8=U8_MOSFET_BANK_1 U9=U9_MOSFET_BANK_1 U?=U?_MOSFET_BANK_1#1 U?=U?_MOSFET_BANK_1#2 U?=U?_MOSFET_BANK_1#3 U?=U?_MOSFET_BANK_1#4; ports ADC_MISO=ADC_MISO ADC_MOSI=ADC_MOSI ADC_nCS=ADC_nCS_MOSFET_BANK_1 ADC_SCLK=ADC_SCLK M1_OUT=M1_OUT M1_TRIG=NetR47_MOSFET_BANK_1_2 M2_OUT=M2_OUT M2_TRIG=NetR57_MOSFET_BANK_1_2 M3_OUT=M3_OUT M3_TRIG=NetR48_MOSFET_BANK_1_2 M4_OUT=M4_OUT M4_TRIG=NetR58_MOSFET_BANK_1_2 STAT_12=NetR17_MOSFET_BANK_1_2 STAT_34=NetR21_MOSFET_BANK_1_2 TEMP_SENSE=TEMP_SENSE_MOSFET_BANK_1
MOSFET_BANK_2: designators C16=C16_MOSFET_BANK_2 C20=C20_MOSFET_BANK_2 C21=C21_MOSFET_BANK_2 C?=C?_MOSFET_BANK_2#1 C?=C?_MOSFET_BANK_2#2 C?=C?_MOSFET_BANK_2#3 C?=C?_MOSFET_BANK_2#4 R17=R17_MOSFET_BANK_2 R18=R18_MOSFET_BANK_2 R21=R21_MOSFET_BANK_2 R22=R22_MOSFET_BANK_2 R23=R23_MOSFET_BANK_2 R41=R41_MOSFET_BANK_2 R46=R46_MOSFET_BANK_2 R47=R47_MOSFET_BANK_2 R48=R48_MOSFET_BANK_2 R57=R57_MOSFET_BANK_2 R58=R58_MOSFET_BANK_2 R84=R84_MOSFET_BANK_2 R85=R85_MOSFET_BANK_2 R97=R97_MOSFET_BANK_2 R98=R98_MOSFET_BANK_2 R101=R101_MOSFET_BANK_2 R104=R104_MOSFET_BANK_2 U8=U8_MOSFET_BANK_2 U9=U9_MOSFET_BANK_2 U?=U?_MOSFET_BANK_2#1 U?=U?_MOSFET_BANK_2#2 U?=U?_MOSFET_BANK_2#3 U?=U?_MOSFET_BANK_2#4; ports ADC_MISO=ADC_MISO ADC_MOSI=ADC_MOSI ADC_nCS=ADC_nCS_MOSFET_BANK_2 ADC_SCLK=ADC_SCLK M1_OUT=M1_OUT M1_TRIG=NetR47_MOSFET_BANK_2_2 M2_OUT=M2_OUT M2_TRIG=NetR57_MOSFET_BANK_2_2 M3_OUT=M3_OUT M3_TRIG=NetR48_MOSFET_BANK_2_2 M4_OUT=M4_OUT M4_TRIG=NetR58_MOSFET_BANK_2_2 STAT_12=NetR17_MOSFET_BANK_2_2 STAT_34=NetR21_MOSFET_BANK_2_2 TEMP_SENSE=TEMP_SENSE_MOSFET_BANK_2
MOSFET_BANK_3: designators C16=C16_MOSFET_BANK_3 C20=C20_MOSFET_BANK_3 C21=C21_MOSFET_BANK_3 C?=C?_MOSFET_BANK_3#1 C?=C?_MOSFET_BANK_3#2 C?=C?_MOSFET_BANK_3#3 C?=C?_MOSFET_BANK_3#4 R17=R17_MOSFET_BANK_3 R18=R18_MOSFET_BANK_3 R21=R21_MOSFET_BANK_3 R22=R22_MOSFET_BANK_3 R23=R23_MOSFET_BANK_3 R41=R41_MOSFET_BANK_3 R46=R46_MOSFET_BANK_3 R47=R47_MOSFET_BANK_3 R48=R48_MOSFET_BANK_3 R57=R57_MOSFET_BANK_3 R58=R58_MOSFET_BANK_3 R84=R84_MOSFET_BANK_3 R85=R85_MOSFET_BANK_3 R97=R97_MOSFET_BANK_3 R98=R98_MOSFET_BANK_3 R101=R101_MOSFET_BANK_3 R104=R104_MOSFET_BANK_3 U8=U8_MOSFET_BANK_3 U9=U9_MOSFET_BANK_3 U?=U?_MOSFET_BANK_3#1 U?=U?_MOSFET_BANK_3#2 U?=U?_MOSFET_BANK_3#3 U?=U?_MOSFET_BANK_3#4; ports ADC_MISO=ADC_MISO ADC_MOSI=ADC_MOSI ADC_nCS=ADC_nCS_MOSFET_BANK_3 ADC_SCLK=ADC_SCLK M1_OUT=M1_OUT M1_TRIG=NetR47_MOSFET_BANK_3_2 M2_OUT=M2_OUT M2_TRIG=NetR57_MOSFET_BANK_3_2 M3_OUT=M3_OUT M3_TRIG=NetR48_MOSFET_BANK_3_2 M4_OUT=M4_OUT M4_TRIG=NetR58_MOSFET_BANK_3_2 STAT_12=NetR17_MOSFET_BANK_3_2 STAT_34=NetR21_MOSFET_BANK_3_2 TEMP_SENSE=TEMP_SENSE_MOSFET_BANK_3

### Notes on the sheet
- INPUTS
- OUTPUTS
- DIVIDER INCLUDED BUT NOT NECESSARY
- 0402 jumper to disconnect STAT pin
- 0603 jumper to maybe add 3V3 zener if necessary
- in case of zener, replace 0402 with res
- PU
- SMART MOSFET IC
- ADC SPI
- (near U8) Maybe add cap?
- STANDALONE ADC IC
- - STAT output only goes high if both connected MOSFETs are toggled simoultaneously
  - STAT output is clamped to 6.1V and can be pulled up to anything, maybe pull up to 3V3?
  - Short circuit protection results in ~6ms oscillation of output and STAT pin
  - Short circuit protection seems to go off aroud 2A
  - Current tolerance decreases with temp
- (near R104) Current limiting resistors
- 2x .1uF caps used but ideally make one of them 1uF if possible (as per DS)
- UNLABELLED RESISTORS ARE 10K
- Labels drawn without touching a wire or pin: I_nFAULT

### Library data of the parts
C16 C20 C21 = CMP-2008-02046-2: as C?#23 on sheet TCAN1146_PWR_MGMT; Package: C0402-BB; Temperature: -55°C to +125°C; ComponentLink2Description: Datasheet; Temperature Characteristic: X5R; Device Class L1: Passive Components; Height: 0.55mm; Lead Free: Yes; ComponentLink2URL: https://content.kemet.com/datasheets/KEM_C1002_X7R_SMD.pdf; Device Class L2: Capacitors; Temperature Range Low: -55°C; Temperature Range High: +125°C; RoHS: TRUE; Octopart: https://octopart.com/c0402c104k8pactu-kemet-140039; Automotive: No; Mouser Description: Capacitor 100 nF 10 VDC 0402; Category: Cap; Voltage Rating: 10 V; Digikey Description: CAP CER 0.1UF 10V X5R 0402; Ipc Land Pattern Name: CAPC10050X50; Device Class L3: Ceramic Capacitors; Manufacturer Part Number: C0402C104K8PACTU
C?#1-C?#4 = CMP-001-00058-1: LARGE PADS, 0402 CAP, CHANGE COMMENT TO MATCH REAL P/N; Capacitor Type: Ceramic; Min Operating Temperature: -55°C; Mounting Technology: Surface Mount; Pins: 2; Case/Package: 0402; RoHS Compliant: Yes; Max Operating Temperature: 85°C
R17 R21 = CMP-009-00206-2: READ THE NAME
R18 R22 = CMP-009-00209-1: READ THE NAME
R23 R47 R48 R57 R58 = CMP-2000-00572-1: Manufacturer: Panasonic; Part Number: ERJ3EKF56R0V
R41 = CMP-2000-00869-1: Manufacturer: Panasonic; Part Number: ERT-J1VR103J
R46 R97 R98 R101 R104 = CMP-2000-00180-1: Manufacturer: Panasonic; Part Number: ERJ-3EKF1001V
R84 R85 = CMP-1012-00623-3: as R4 on sheet TCAN1146_PWR_MGMT; Number of Pins: 2; Package Reference: 603; Depth: 0.8mm; Mount: SurfaceMount; Package Description: 2-Pin Surface Mount Device, Body 1.6 x 0.85 mm; Datasheet Version: 02/2017; Length: 1.6mm; Lead Free: LeadFree; Height: 0.45mm; Number of Terminations: 2; Max Power Dissipation: 100mW; Min Operating Temperature: -55degC; Datasheet URL: https://industrial.panasonic.com/cdbs/www-data/pdf/RDA0000/AOA0000C304.pdf; Termination: SMD/SMT; Case Code (Metric): 1608; Case Code (Imperial): 0603; Tolerance: 1%; Max Operating Temperature: 155degC; RoHSCompliant: true; Voltage Rating (DC): 75V; Radiation Hardening: No; Packaging: TapeandReel; Composition: ThickFilm; Mounting Technology: SurfaceMount; Manufacturer URL: http://www.panasonic.com/; Width: 0.031inch; REACH SVHC: NoSVHC; Contact Plating: Tin; Military Standard: Not; Package Quantity: 1
U8 = CMP-1095-00041-1: Smart High-Side Power Switch for Industrial Applications 4 Channels: 4 x 140 mOhm Status Feedback, 5.5 to 40 V Operating, -30 to 85 degC, PG-DSO-20-32, Reel, Green; Manufacturer: Infineon; Green: TRUE; Operating Voltage Range (max): 40 V; Operating Voltage Range (min): 5.5Â V; Ptot (max): 3.6Â W; Diagnostic: Digital; IL (nom)min - one channel active: 2.3Â A; RON (max) @ Tj max: 280 mOhm; RON @ 25 degC: 140 mOhm (max); IL (SC): 9 A; IL (nom)min - all channels active: 1.3Â A; toff (max): 270 us; Channels: 4; ton (max): 250 us; ComponentLink1Description: Manufacturer URL; Packing: Reel; ComponentLink3Description: Package Specification; ComponentLink1URL: http://www.infineon.com/; Halogen-free: available; Mounting Technology: Surface Mount; PartNumber: ITS716G; ComponentLink3URL: http://www.infineon.com/dgdl/BTS+4130QGA_DS10+_neu.pdf?folderId=db3a304314dca389011537739e37155f&fileId=db3a30431a5c32f2011a957932285680&sId=db3a30433d68e984013d7f42d6576278; PackageVersion: Mar-08; ComponentLink2Description: Datasheet; ComponentLink2URL: http://www.infineon.com/dgdl/ITS716G_DS11_20081002.pdf?folderId=db3a304412b407950112b408e8c90004&fileId=db3a304412b407950112b428c2cf3e6d; DatasheetVersion: Rev. 1.1; PackageDescription: 20-Pin Plastic (Green) Dual Small Outline Package, 12.7 x 7.5 mm Body, 1.27 mm Pitch; Load Current (typ): 1.3Â A; PackageReference: PG-DSO-20-32; IL (SCp): 9 A
U9 = CMP-0054-00372-2: 8-Channel, 50 kSPS to 200 kSPS, 8-Bit A/D Converter, 16-pin TSSOP, Pb-Free; Manufacturer: National Semiconductor; PackageTopMarking: NSUZXYTT*88S022*CIMT; CompType: ADC IC; PowerWise: Y; ComponentLink2URL: http://www.national.com/pf/AD/ADC088S022.html; RoHS: Y; PackageDescription: Molded TSSOP, Jedec, 5 x 4.4 x 0.9mm Body, 16 Lead, 0.65mm Pitch; DatasheetVersion: Feb-2010; PinCount: 16; ComponentLink1Description: ADC088S022 Datasheet; Code_JEDEC: MO-153-AB; ComponentLink3URL: http://www.national.com/packaging/folders/mtc16.html; PackageVersion: revD, Jun-2003; ComponentLink3Description: MTC16 Package Page; RevisionNote: Component URLs added; ComponentLink1URL: http://www.national.com/ds/AD/ADC088S022.pdf; ComponentLink2Description: ADC088S022 Web Page; PackageReference: MTC16
U?#1-U?#4 = CMP-1557-00012-2: SENSOR CURRENT HALL 12.5A AC/DC; Number of Channels: 1; Min Supply Voltage: 3V; Sensitivity: 110mV/A; Response Time: 4.6us; Operating Supply Voltage: 3.3V; Max Supply Voltage: 5.5V; Max Supply Current: 5.5mA; Bandwidth: 100kHz; Linearity: 1%; Quiescent Current: 4mA; Accuracy: 5%; Polarity: Bidirectional; Case/Package: SOIC; Packaging: Tape and Reel; Number of Pins: 8; Width: 3.9mm; Frequency: 100kHz; -3db Bandwidth: 100kHz; REACH SVHC: No SVHC; Series: -; Height: 1.5mm; Package Quantity: 1; Min Operating Temperature: -40°C; Max Operating Temperature: 125°C; Current Sensing: 12.5A; RoHS Compliant: Yes; Length: 4.9mm